# EAGLE schematic axiom_beta_main_board_v0.37_r1.2 (EAGLE 7.7.0)
Assembly variants: Beta, Tele, Min

## Sheet 1 of 6
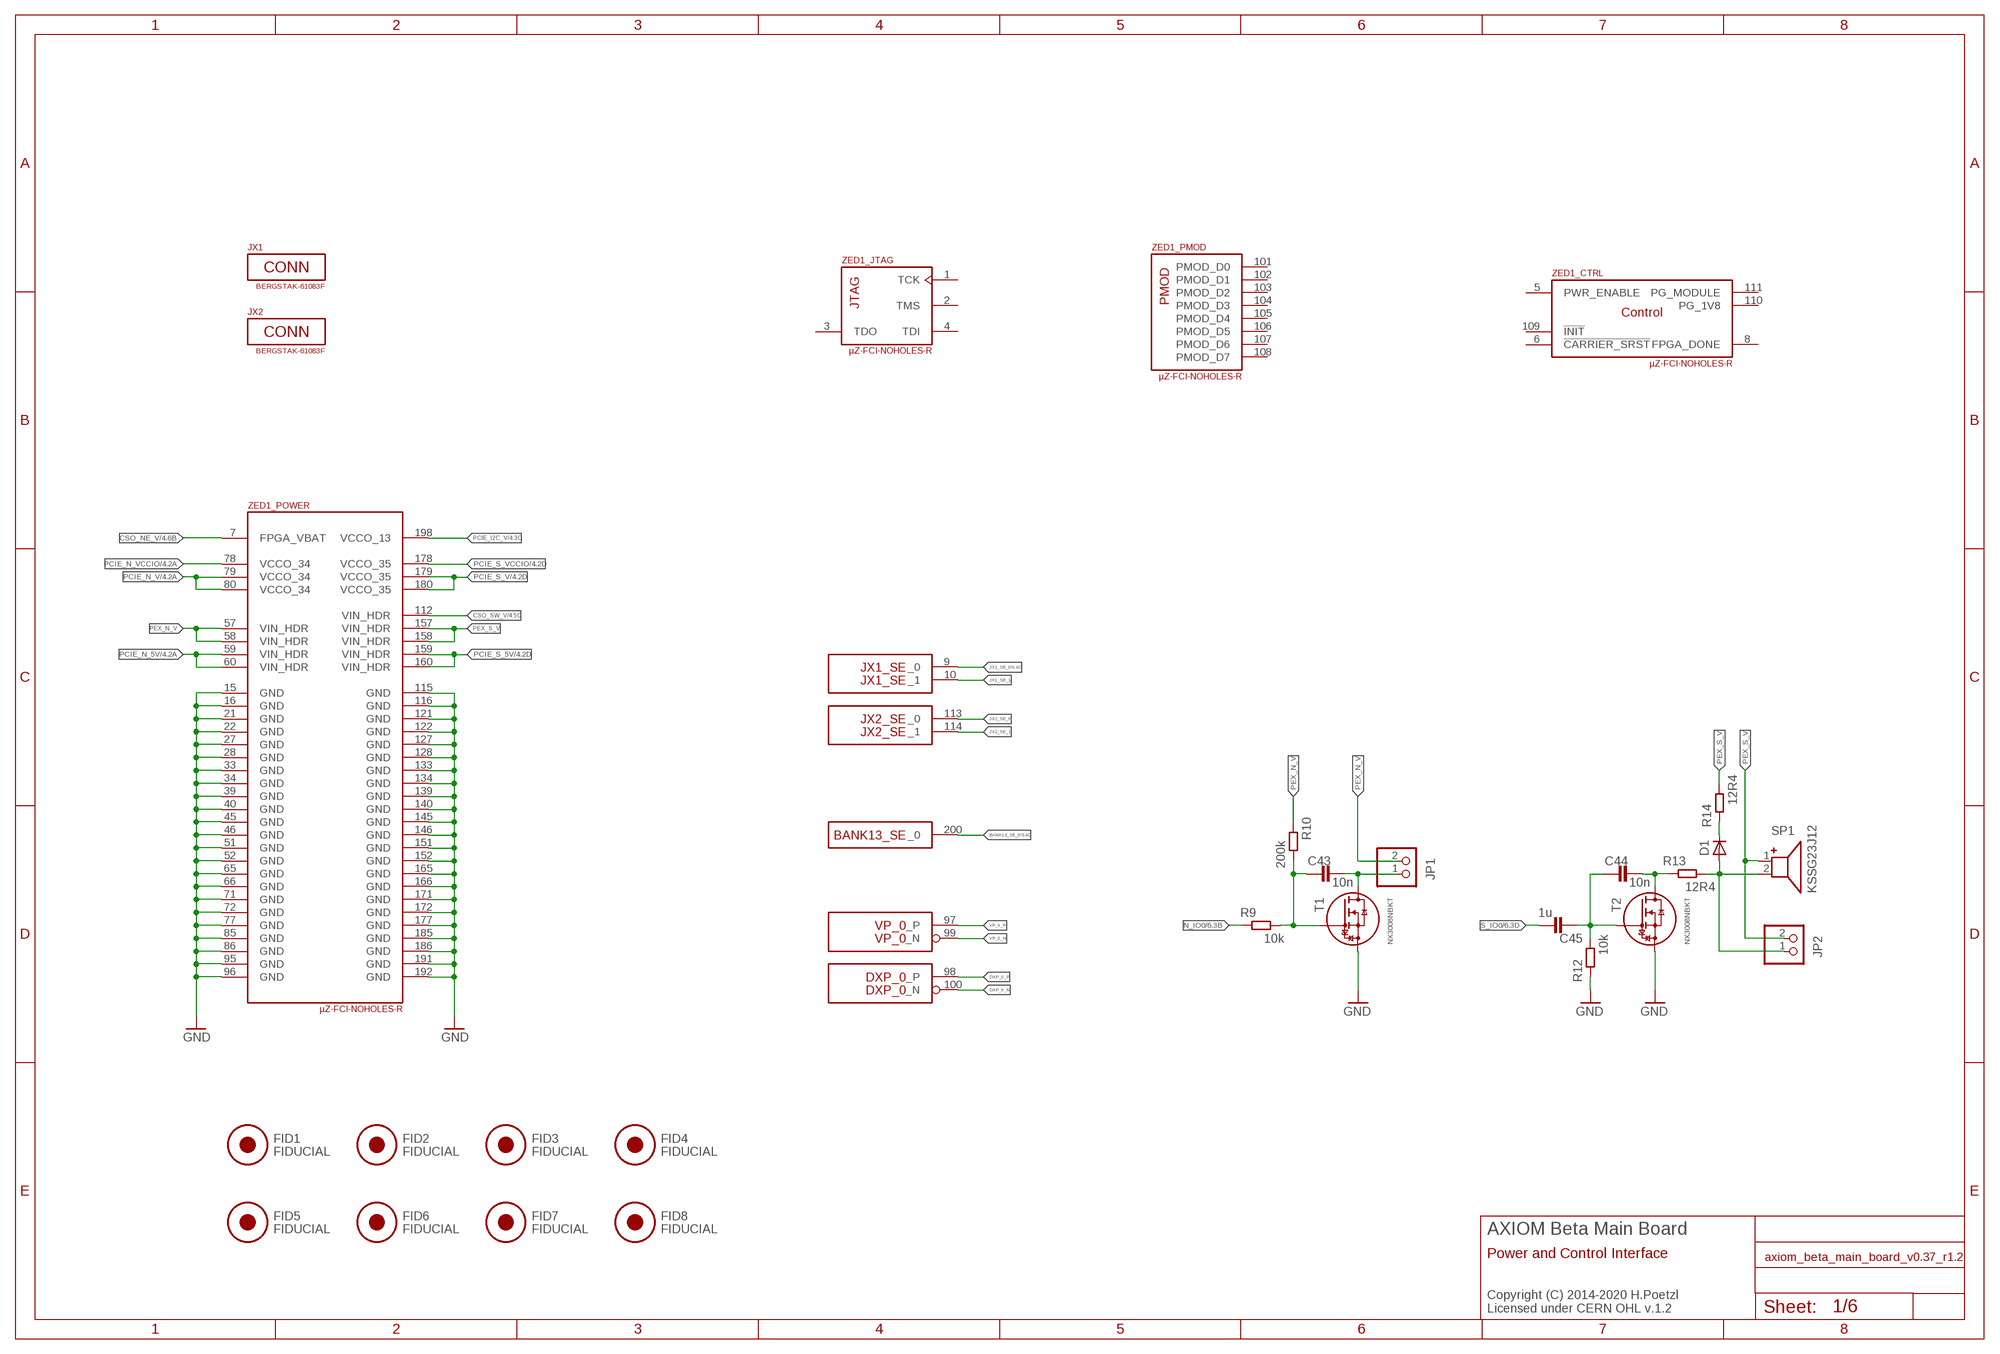
[diagram p0: schematic, sheet 1]

### Parts
C43  10n  C0402-B  [0402-B]
C44  10n  C0402-B  [0402-B]  (not fitted in variant Tele)
C45  1u  C0402-B  [0402-B]  (not fitted in variant Tele)
D1  DB2S20500L  DIODE-MICROMELF-R  [MICROMELF-R]  (not fitted in variant Tele)
FID1  FIDUCIAL  [FID_ARROW]
FID2  FIDUCIAL  [FID_ARROW]
FID3  FIDUCIAL  [FID_ARROW]
FID4  FIDUCIAL  [FID_ARROW]
FID5  FIDUCIAL  [FID_ARROW]
FID6  FIDUCIAL  [FID_ARROW]
FID7  FIDUCIAL  [FID_ARROW]
FID8  FIDUCIAL  [FID_ARROW]
JP1  PINHD-1X02_2.00-90°-S  [1X02M/90-S]
JP2  PINHD-1X02_2.00  [1X02M]  (not fitted in variant Beta)  (not fitted in variant Tele)
JX1  BERGSTAK-61083F  [61083-FAKE]  (not fitted in variant Beta)  (not fitted in variant Min)
JX2  BERGSTAK-61083F  [61083-FAKE]  (not fitted in variant Beta)  (not fitted in variant Min)
R9  10k  R0402-B  [0402-B]
R10  200k  R0402-B  [0402-B]
R12  10k  R0402-B  [0402-B]  (not fitted in variant Tele)
R13  12R4  R0402-B  [0402-B]  (not fitted in variant Tele)
R14  12R4  R0402-B  [0402-B]  (not fitted in variant Tele)
SP1  KSSG23J12  [KSSG23J12]  (not fitted in variant Beta)  (not fitted in variant Tele)
T1  NX3008NBKT  [SOT416]
T2  NX3008NBKT  [SOT416]  (not fitted in variant Tele)
ZED1  µZ-FCI-NOHOLES-R  [µZ-NOHOLES-R]  (not fitted in variant Tele)

### Nets
BANK13_SE_0: ZED1.200(BANK13_SE:_0) ; also sheet 5
CSO_NE_V [power]: ZED1.7(_POWER:FPGA_VBAT) ; also sheet 4
CSO_SW_V [power]: ZED1.112(_POWER:VIN_HDR) ; also sheet 4
DXP_0_N: ZED1.100(DXP_0:_N)
DXP_0_P: ZED1.98(DXP_0:_P)
GND: R12.1 T1.2(S) T2.2(S) ZED1.15(_POWER:GND) ZED1.16(_POWER:GND) ZED1.21(_POWER:GND) ZED1.22(_POWER:GND) ZED1.27(_POWER:GND) ZED1.28(_POWER:GND) ZED1.33(_POWER:GND) ZED1.34(_POWER:GND) ZED1.39(_POWER:GND) ZED1.40(_POWER:GND) ZED1.45(_POWER:GND) ZED1.46(_POWER:GND) ZED1.51(_POWER:GND) ZED1.52(_POWER:GND) ZED1.65(_POWER:GND) ZED1.66(_POWER:GND) ZED1.71(_POWER:GND) ZED1.72(_POWER:GND) ZED1.77(_POWER:GND) ZED1.85(_POWER:GND) ZED1.86(_POWER:GND) ZED1.95(_POWER:GND) ZED1.96(_POWER:GND) ZED1.115(_POWER:GND) ZED1.116(_POWER:GND) ZED1.121(_POWER:GND) ZED1.122(_POWER:GND) ZED1.127(_POWER:GND) ZED1.128(_POWER:GND) ZED1.133(_POWER:GND) ZED1.134(_POWER:GND) ZED1.139(_POWER:GND) ZED1.140(_POWER:GND) ZED1.145(_POWER:GND) ZED1.146(_POWER:GND) ZED1.151(_POWER:GND) ZED1.152(_POWER:GND) ZED1.165(_POWER:GND) ZED1.166(_POWER:GND) ZED1.171(_POWER:GND) ZED1.172(_POWER:GND) ZED1.177(_POWER:GND) ZED1.185(_POWER:GND) ZED1.186(_POWER:GND) ZED1.191(_POWER:GND) ZED1.192(_POWER:GND) ; also sheet 3,4,5,6
JX1_SE_0: ZED1.9(JX1_SE:_0) ; also sheet 6
JX1_SE_1: ZED1.10(JX1_SE:_1)
JX2_SE_0: ZED1.113(JX2_SE:_0)
JX2_SE_1: ZED1.114(JX2_SE:_1)
N$105: C43.2 JP1.1 T1.3(D)
N$112: C44.2 R13.1 T2.3(D)
N$113: D1.C R14.1
N$115: D1.A JP2.1 R13.2 SP1.2
N$1111: C43.1 R9.2 R10.2 T1.1(G)
N$1112: C44.1 C45.1 R12.2 T2.1(G)
N_IO0: R9.1 ; also sheet 6
PCIE_I2C_V [power]: ZED1.198(_POWER:VCCO_13) ; also sheet 4
PCIE_N_5V [power]: ZED1.59(_POWER:VIN_HDR) ZED1.60(_POWER:VIN_HDR) ; also sheet 4
PCIE_N_V [power]: ZED1.79(_POWER:VCCO_34) ZED1.80(_POWER:VCCO_34) ; also sheet 4
PCIE_N_VCCIO [power]: ZED1.78(_POWER:VCCO_34) ; also sheet 4
PCIE_S_5V [power]: ZED1.159(_POWER:VIN_HDR) ZED1.160(_POWER:VIN_HDR) ; also sheet 4
PCIE_S_V [power]: ZED1.179(_POWER:VCCO_35) ZED1.180(_POWER:VCCO_35) ; also sheet 4
PCIE_S_VCCIO [power]: ZED1.178(_POWER:VCCO_35) ; also sheet 4
PEX_N_V [power]: JP1.2 R10.1 ZED1.57(_POWER:VIN_HDR) ZED1.58(_POWER:VIN_HDR)
PEX_S_V [power]: JP2.2 R14.2 SP1.1 ZED1.157(_POWER:VIN_HDR) ZED1.158(_POWER:VIN_HDR)
S_IO0: C45.2 ; also sheet 6
VP_0_N: ZED1.99(VP_0:_N)
VP_0_P: ZED1.97(VP_0:_P)
Unconnected: ZED1.1(_JTAG:TCK) ZED1.2(_JTAG:TMS) ZED1.3(_JTAG:TDO) ZED1.4(_JTAG:TDI) ZED1.5(_CTRL:PWR_ENABLE) ZED1.6(_CTRL:!CARRIER_SRST) ZED1.8(_CTRL:FPGA_DONE) ZED1.101(_PMOD:PMOD_D0) ZED1.102(_PMOD:PMOD_D1) ZED1.103(_PMOD:PMOD_D2) ZED1.104(_PMOD:PMOD_D3) ZED1.105(_PMOD:PMOD_D4) ZED1.106(_PMOD:PMOD_D5) ZED1.107(_PMOD:PMOD_D6) ZED1.108(_PMOD:PMOD_D7) ZED1.109(_CTRL:!INIT) ZED1.110(_CTRL:PG_1V8) ZED1.111(_CTRL:PG_MODULE)

### Notes on the sheet
- AXIOM Beta Main Board
- Power and Control Interface
- Copyright (C) 2014-2020 H.Poetzl
  Licensed under CERN OHL v.1.2

## Sheet 2 of 6
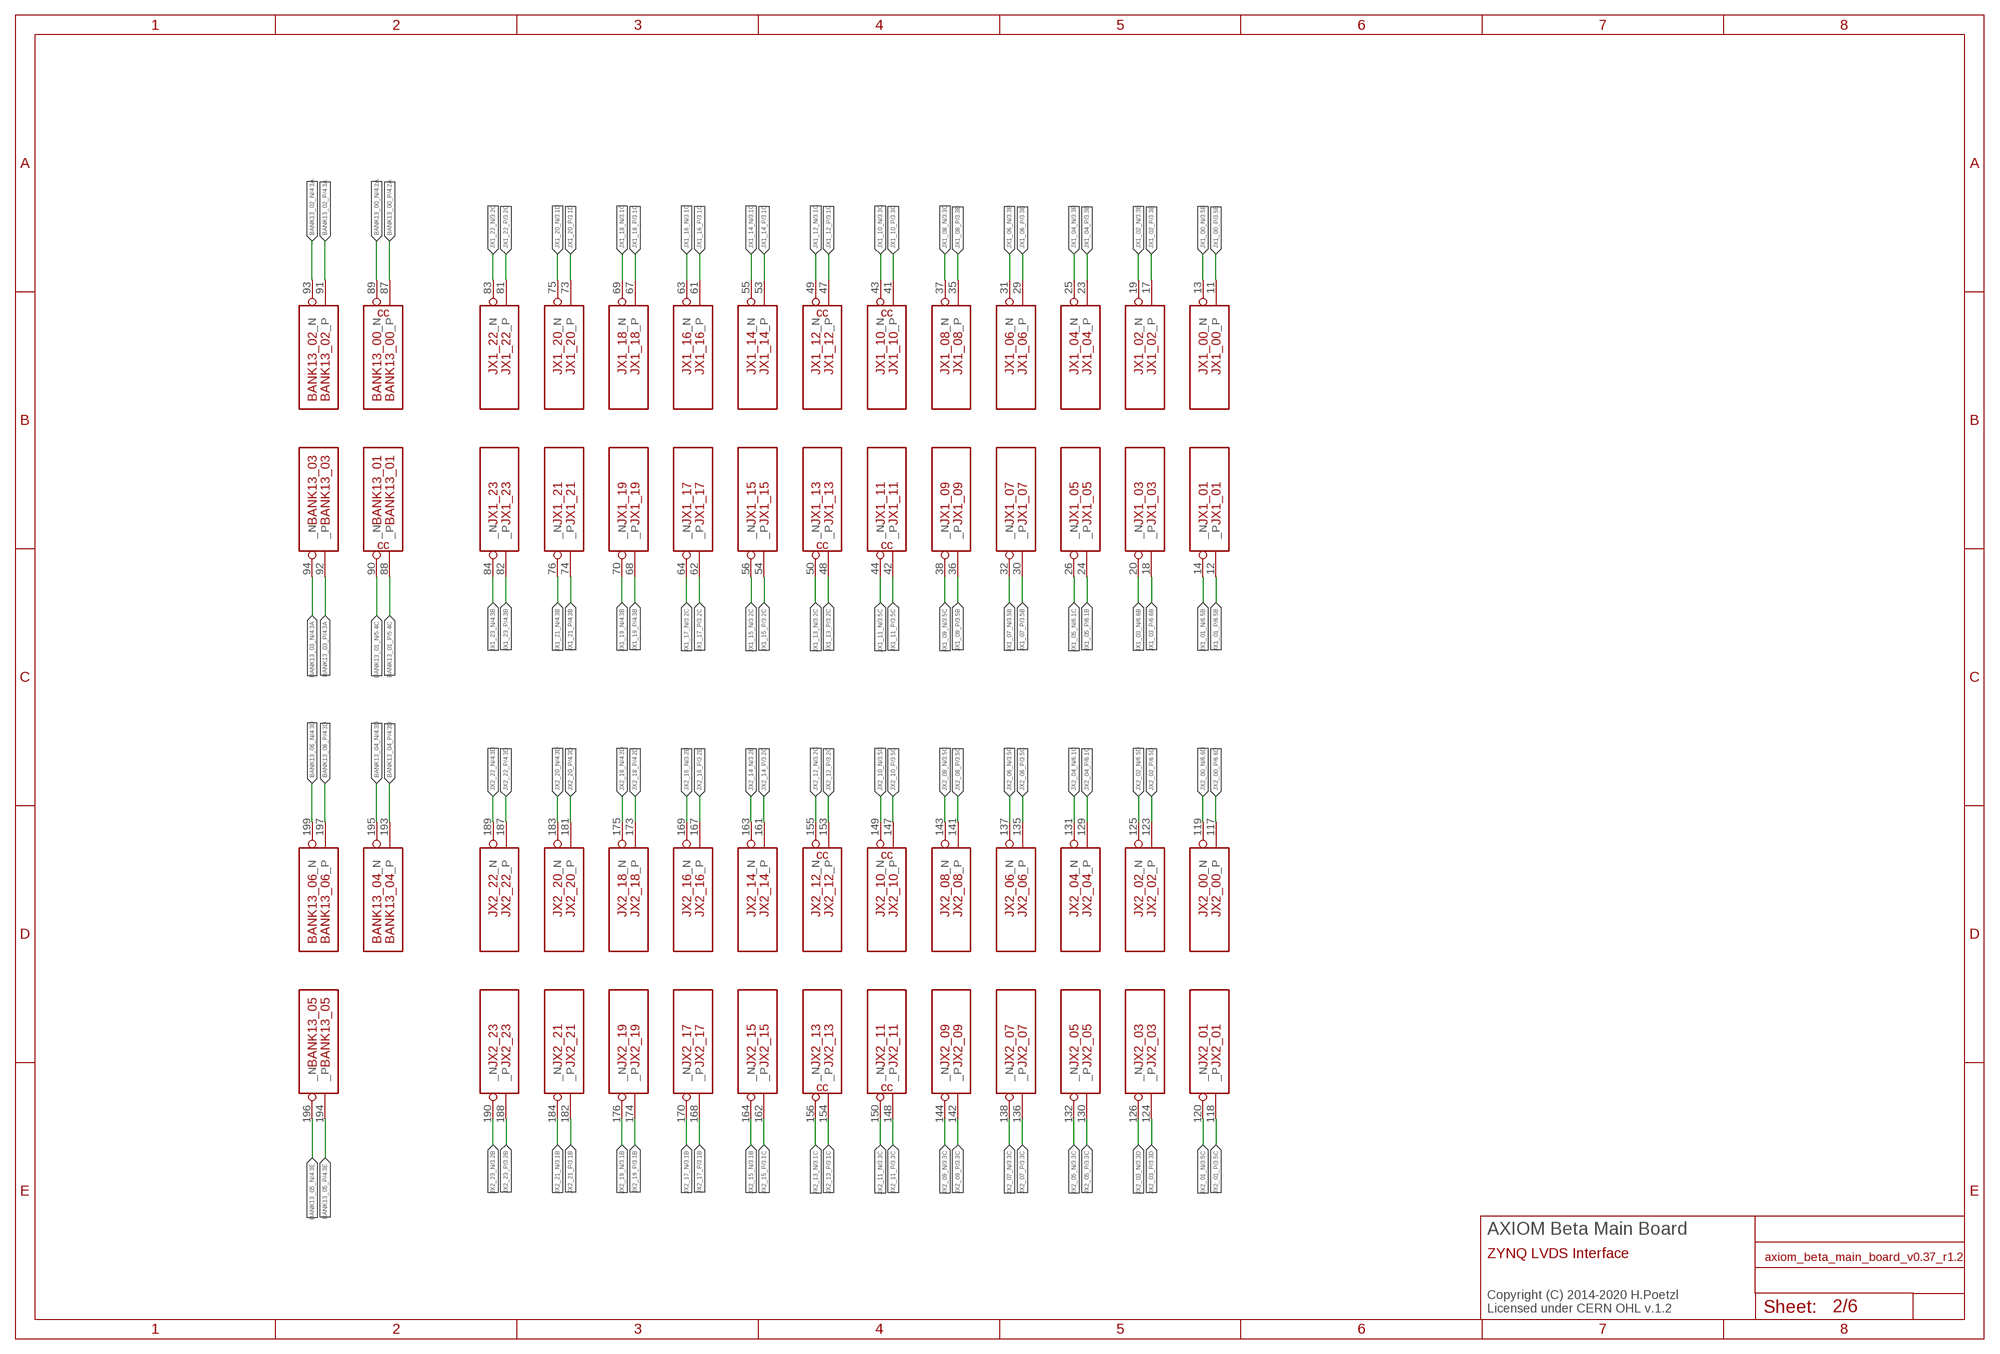
[diagram p1: schematic, sheet 2]

### Nets
BANK13_00_N [LVDS]: ZED1.89(BANK13_00:_N) ; also sheet 4
BANK13_00_P [LVDS]: ZED1.87(BANK13_00:_P) ; also sheet 4
BANK13_01_N [LVDS]: ZED1.90(BANK13_01:_N) ; also sheet 5
BANK13_01_P [LVDS]: ZED1.88(BANK13_01:_P) ; also sheet 5
BANK13_02_N [LVDS]: ZED1.93(BANK13_02:_N) ; also sheet 4
BANK13_02_P [LVDS]: ZED1.91(BANK13_02:_P) ; also sheet 4
BANK13_03_N [LVDS]: ZED1.94(BANK13_03:_N) ; also sheet 4
BANK13_03_P [LVDS]: ZED1.92(BANK13_03:_P) ; also sheet 4
BANK13_04_N [LVDS]: ZED1.195(BANK13_04:_N) ; also sheet 4
BANK13_04_P [LVDS]: ZED1.193(BANK13_04:_P) ; also sheet 4
BANK13_05_N [LVDS]: ZED1.196(BANK13_05:_N) ; also sheet 4
BANK13_05_P [LVDS]: ZED1.194(BANK13_05:_P) ; also sheet 4
BANK13_06_N [LVDS]: ZED1.199(BANK13_06:_N) ; also sheet 4
BANK13_06_P [LVDS]: ZED1.197(BANK13_06:_P) ; also sheet 4
JX1_00_N [LVDS]: ZED1.13(JX1_00:_N) ; also sheet 3
JX1_00_P [LVDS]: ZED1.11(JX1_00:_P) ; also sheet 3
JX1_01_N [LVDS]: ZED1.14(JX1_01:_N) ; also sheet 6
JX1_01_P [LVDS]: ZED1.12(JX1_01:_P) ; also sheet 6
JX1_02_N [LVDS]: ZED1.19(JX1_02:_N) ; also sheet 3
JX1_02_P [LVDS]: ZED1.17(JX1_02:_P) ; also sheet 3
JX1_03_N [LVDS]: ZED1.20(JX1_03:_N) ; also sheet 6
JX1_03_P [LVDS]: ZED1.18(JX1_03:_P) ; also sheet 6
JX1_04_N [LVDS]: ZED1.25(JX1_04:_N) ; also sheet 3
JX1_04_P [LVDS]: ZED1.23(JX1_04:_P) ; also sheet 3
JX1_05_N [LVDS]: ZED1.26(JX1_05:_N) ; also sheet 6
JX1_05_P [LVDS]: ZED1.24(JX1_05:_P) ; also sheet 6
JX1_06_N [LVDS]: ZED1.31(JX1_06:_N) ; also sheet 3
JX1_06_P [LVDS]: ZED1.29(JX1_06:_P) ; also sheet 3
JX1_07_N [LVDS]: ZED1.32(JX1_07:_N) ; also sheet 3
JX1_07_P [LVDS]: ZED1.30(JX1_07:_P) ; also sheet 3
JX1_08_N [LVDS]: ZED1.37(JX1_08:_N) ; also sheet 3
JX1_08_P [LVDS]: ZED1.35(JX1_08:_P) ; also sheet 3
JX1_09_N [LVDS]: ZED1.38(JX1_09:_N) ; also sheet 3
JX1_09_P [LVDS]: ZED1.36(JX1_09:_P) ; also sheet 3
JX1_10_N [LVDS]: ZED1.43(JX1_10:_N) ; also sheet 3
JX1_10_P [LVDS]: ZED1.41(JX1_10:_P) ; also sheet 3
JX1_11_N [LVDS]: ZED1.44(JX1_11:_N) ; also sheet 3
JX1_11_P [LVDS]: ZED1.42(JX1_11:_P) ; also sheet 3
JX1_12_N [LVDS]: ZED1.49(JX1_12:_N) ; also sheet 3
JX1_12_P [LVDS]: ZED1.47(JX1_12:_P) ; also sheet 3
JX1_13_N [LVDS]: ZED1.50(JX1_13:_N) ; also sheet 3
JX1_13_P [LVDS]: ZED1.48(JX1_13:_P) ; also sheet 3
JX1_14_N: ZED1.55(JX1_14:_N) ; also sheet 3
JX1_14_P [LVDS]: ZED1.53(JX1_14:_P) ; also sheet 3
JX1_15_N [LVDS]: ZED1.56(JX1_15:_N) ; also sheet 3
JX1_15_P [LVDS]: ZED1.54(JX1_15:_P) ; also sheet 3
JX1_16_N [LVDS]: ZED1.63(JX1_16:_N) ; also sheet 3
JX1_16_P [LVDS]: ZED1.61(JX1_16:_P) ; also sheet 3
JX1_17_N [LVDS]: ZED1.64(JX1_17:_N) ; also sheet 3
JX1_17_P [LVDS]: ZED1.62(JX1_17:_P) ; also sheet 3
JX1_18_N [LVDS]: ZED1.69(JX1_18:_N) ; also sheet 3
JX1_18_P [LVDS]: ZED1.67(JX1_18:_P) ; also sheet 3
JX1_19_N [LVDS]: ZED1.70(JX1_19:_N) ; also sheet 4
JX1_19_P [LVDS]: ZED1.68(JX1_19:_P) ; also sheet 4
JX1_20_N [LVDS]: ZED1.75(JX1_20:_N) ; also sheet 3
JX1_20_P [LVDS]: ZED1.73(JX1_20:_P) ; also sheet 3
JX1_21_N [LVDS]: ZED1.76(JX1_21:_N) ; also sheet 4
JX1_21_P [LVDS]: ZED1.74(JX1_21:_P) ; also sheet 4
JX1_22_N [LVDS]: ZED1.83(JX1_22:_N) ; also sheet 3
JX1_22_P [LVDS]: ZED1.81(JX1_22:_P) ; also sheet 3
JX1_23_N [LVDS]: ZED1.84(JX1_23:_N) ; also sheet 4
JX1_23_P [LVDS]: ZED1.82(JX1_23:_P) ; also sheet 4
JX2_00_N [LVDS]: ZED1.119(JX2_00:_N) ; also sheet 6
JX2_00_P [LVDS]: ZED1.117(JX2_00:_P) ; also sheet 6
JX2_01_N [LVDS]: ZED1.120(JX2_01:_N) ; also sheet 3
JX2_01_P [LVDS]: ZED1.118(JX2_01:_P) ; also sheet 3
JX2_02_N [LVDS]: ZED1.125(JX2_02:_N) ; also sheet 6
JX2_02_P [LVDS]: ZED1.123(JX2_02:_P) ; also sheet 6
JX2_03_N [LVDS]: ZED1.126(JX2_03:_N) ; also sheet 3
JX2_03_P [LVDS]: ZED1.124(JX2_03:_P) ; also sheet 3
JX2_04_N [LVDS]: ZED1.131(JX2_04:_N) ; also sheet 6
JX2_04_P [LVDS]: ZED1.129(JX2_04:_P) ; also sheet 6
JX2_05_N [LVDS]: ZED1.132(JX2_05:_N) ; also sheet 3
JX2_05_P [LVDS]: ZED1.130(JX2_05:_P) ; also sheet 3
JX2_06_N [LVDS]: ZED1.137(JX2_06:_N) ; also sheet 3
JX2_06_P [LVDS]: ZED1.135(JX2_06:_P) ; also sheet 3
JX2_07_N [LVDS]: ZED1.138(JX2_07:_N) ; also sheet 3
JX2_07_P [LVDS]: ZED1.136(JX2_07:_P) ; also sheet 3
JX2_08_N [LVDS]: ZED1.143(JX2_08:_N) ; also sheet 3
JX2_08_P [LVDS]: ZED1.141(JX2_08:_P) ; also sheet 3
JX2_09_N [LVDS]: ZED1.144(JX2_09:_N) ; also sheet 3
JX2_09_P [LVDS]: ZED1.142(JX2_09:_P) ; also sheet 3
JX2_10_N [LVDS]: ZED1.149(JX2_10:_N) ; also sheet 3
JX2_10_P [LVDS]: ZED1.147(JX2_10:_P) ; also sheet 3
JX2_11_N [LVDS]: ZED1.150(JX2_11:_N) ; also sheet 3
JX2_11_P [LVDS]: ZED1.148(JX2_11:_P) ; also sheet 3
JX2_12_N [LVDS]: ZED1.155(JX2_12:_N) ; also sheet 3
JX2_12_P [LVDS]: ZED1.153(JX2_12:_P) ; also sheet 3
JX2_13_N [LVDS]: ZED1.156(JX2_13:_N) ; also sheet 3
JX2_13_P [LVDS]: ZED1.154(JX2_13:_P) ; also sheet 3
JX2_14_N [LVDS]: ZED1.163(JX2_14:_N) ; also sheet 3
JX2_14_P [LVDS]: ZED1.161(JX2_14:_P) ; also sheet 3
JX2_15_N [LVDS]: ZED1.164(JX2_15:_N) ; also sheet 3
JX2_15_P [LVDS]: ZED1.162(JX2_15:_P) ; also sheet 3
JX2_16_N [LVDS]: ZED1.169(JX2_16:_N) ; also sheet 3
JX2_16_P [LVDS]: ZED1.167(JX2_16:_P) ; also sheet 3
JX2_17_N [LVDS]: ZED1.170(JX2_17:_N) ; also sheet 3
JX2_17_P [LVDS]: ZED1.168(JX2_17:_P) ; also sheet 3
JX2_18_N [LVDS]: ZED1.175(JX2_18:_N) ; also sheet 4
JX2_18_P [LVDS]: ZED1.173(JX2_18:_P) ; also sheet 4
JX2_19_N [LVDS]: ZED1.176(JX2_19:_N) ; also sheet 3
JX2_19_P [LVDS]: ZED1.174(JX2_19:_P) ; also sheet 3
JX2_20_N [LVDS]: ZED1.183(JX2_20:_N) ; also sheet 4
JX2_20_P [LVDS]: ZED1.181(JX2_20:_P) ; also sheet 4
JX2_21_N [LVDS]: ZED1.184(JX2_21:_N) ; also sheet 3
JX2_21_P [LVDS]: ZED1.182(JX2_21:_P) ; also sheet 3
JX2_22_N [LVDS]: ZED1.189(JX2_22:_N) ; also sheet 4
JX2_22_P [LVDS]: ZED1.187(JX2_22:_P) ; also sheet 4
JX2_23_N [LVDS]: ZED1.190(JX2_23:_N) ; also sheet 3
JX2_23_P [LVDS]: ZED1.188(JX2_23:_P) ; also sheet 3

### Notes on the sheet
- AXIOM Beta Main Board
- ZYNQ LVDS Interface
- Copyright (C) 2014-2020 H.Poetzl
  Licensed under CERN OHL v.1.2

## Sheet 3 of 6
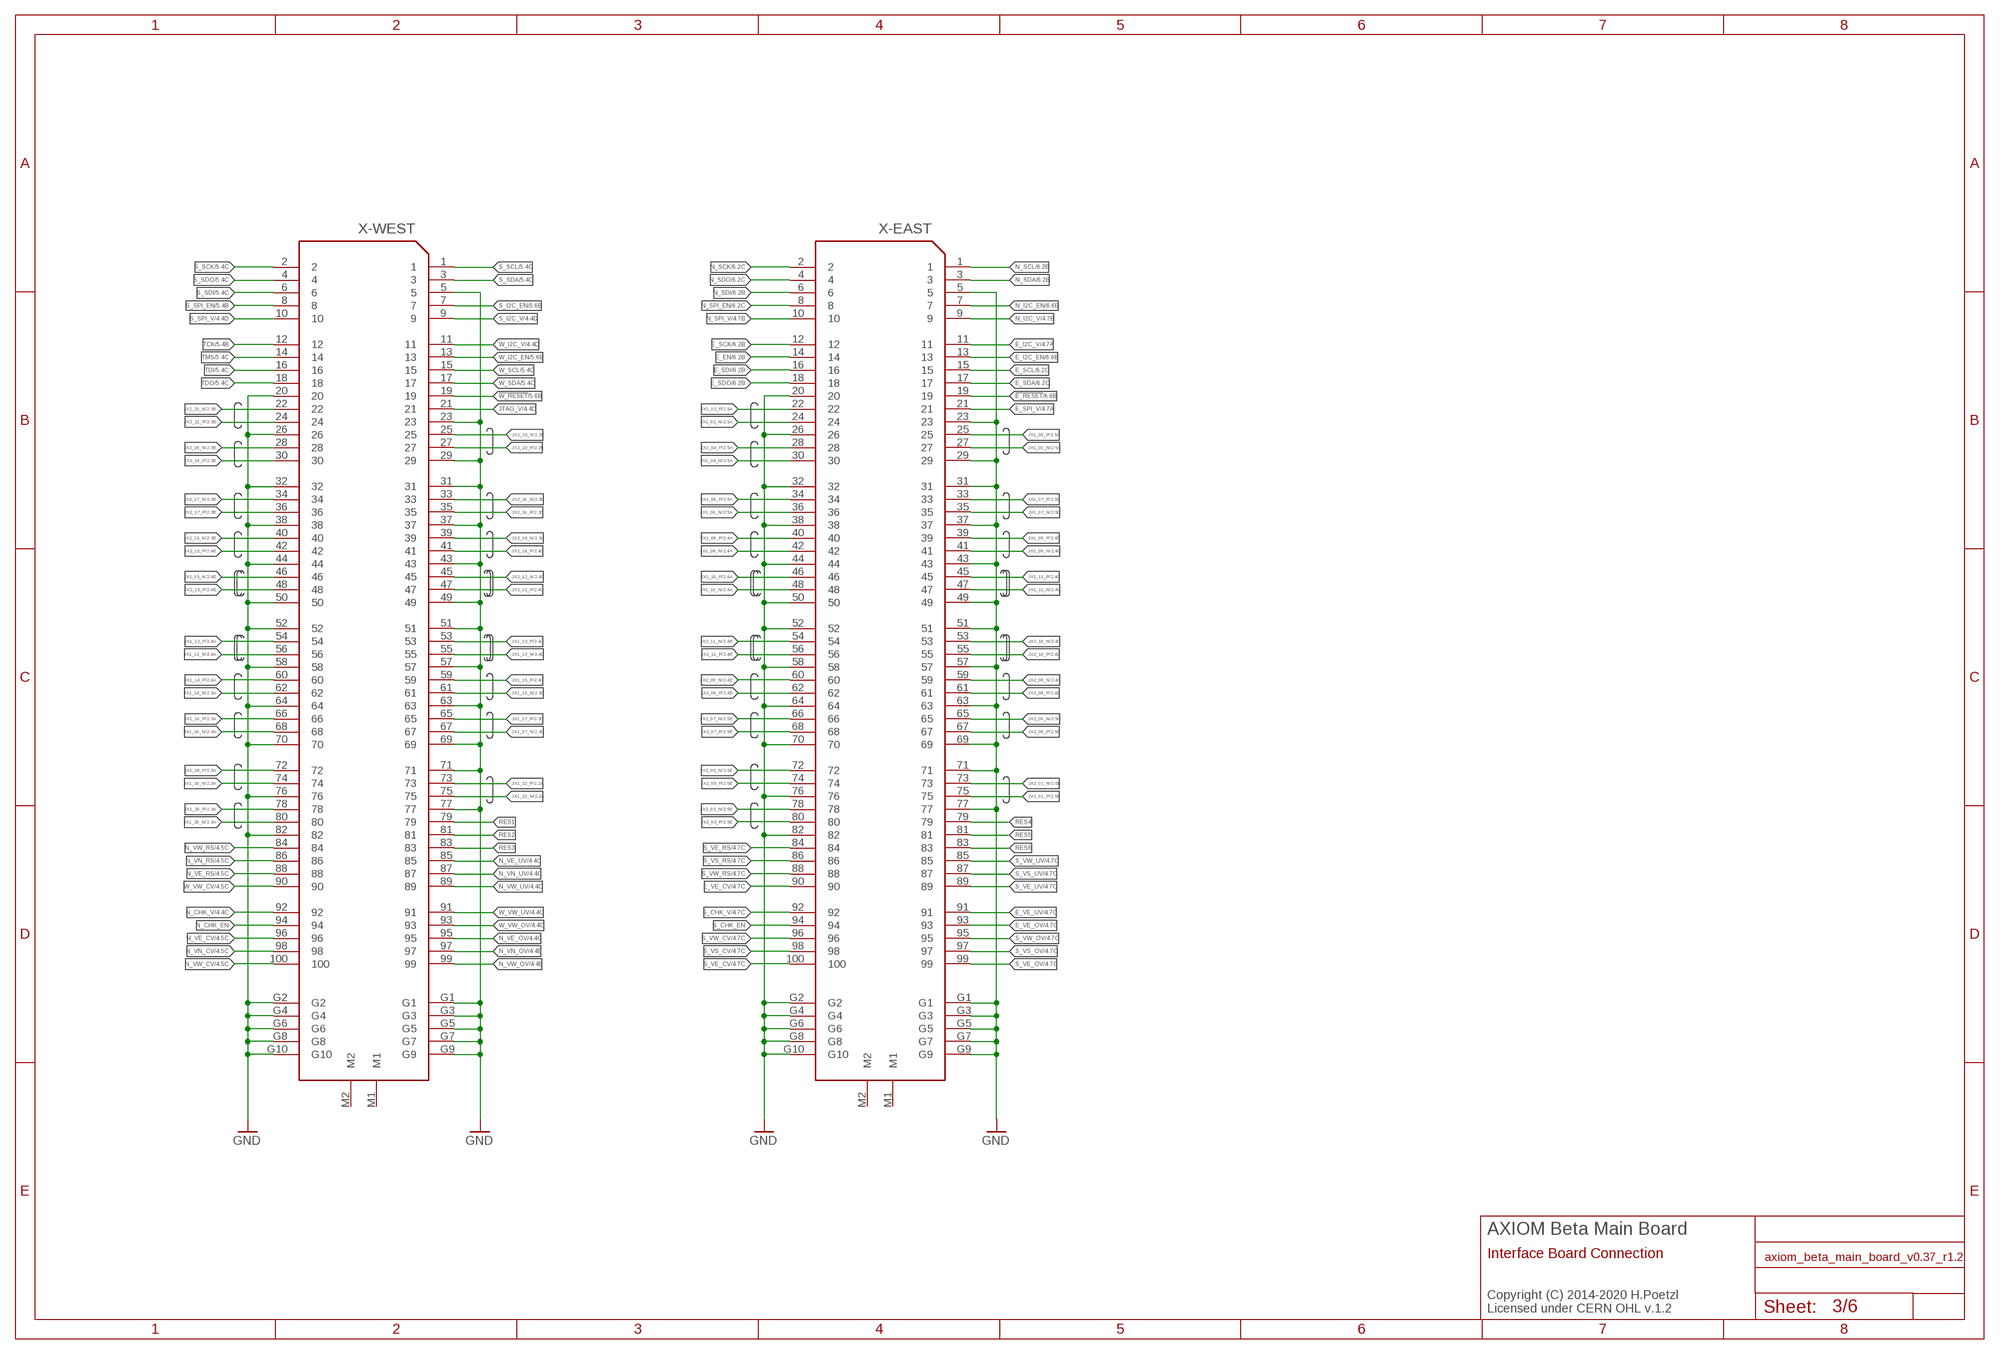
[diagram p2: schematic, sheet 3]

### Parts
X-EAST  FX10-100/10S  [FX10A-100S/10]
X-WEST  FX10-100/10S  [FX10A-100S/10]

### Nets
!E_RESET!: X-EAST.19 ; also sheet 6
!W_RESET!: X-WEST.19 ; also sheet 5
E_EN: X-EAST.14 ; also sheet 6
E_I2C_EN: X-EAST.13 ; also sheet 6
E_I2C_V [power]: X-EAST.11 ; also sheet 4
E_SCK: X-EAST.12 ; also sheet 6
E_SCL: X-EAST.15 ; also sheet 6
E_SDA: X-EAST.17 ; also sheet 6
E_SDI: X-EAST.16 ; also sheet 6
E_SDO: X-EAST.18 ; also sheet 6
E_SPI_V [power]: X-EAST.21 ; also sheet 4
E_VE_CV: X-EAST.90 ; also sheet 4
E_VE_OV: X-EAST.93 ; also sheet 4
E_VE_UV: X-EAST.91 ; also sheet 4
GND: X-EAST.5 X-EAST.20 X-EAST.23 X-EAST.26 X-EAST.29 X-EAST.31 X-EAST.32 X-EAST.37 X-EAST.38 X-EAST.43 X-EAST.44 X-EAST.49 X-EAST.50 X-EAST.51 X-EAST.52 X-EAST.57 X-EAST.58 X-EAST.63 X-EAST.64 X-EAST.69 X-EAST.70 X-EAST.71 X-EAST.76 X-EAST.77 X-EAST.82 X-EAST.G1 X-EAST.G2 X-EAST.G3 X-EAST.G4 X-EAST.G5 X-EAST.G6 X-EAST.G7 X-EAST.G8 X-EAST.G9 X-EAST.G10 X-WEST.5 X-WEST.20 X-WEST.23 X-WEST.26 X-WEST.29 X-WEST.31 X-WEST.32 X-WEST.37 X-WEST.38 X-WEST.43 X-WEST.44 X-WEST.49 X-WEST.50 X-WEST.51 X-WEST.52 X-WEST.57 X-WEST.58 X-WEST.63 X-WEST.64 X-WEST.69 X-WEST.70 X-WEST.71 X-WEST.76 X-WEST.77 X-WEST.82 X-WEST.G1 X-WEST.G2 X-WEST.G3 X-WEST.G4 X-WEST.G5 X-WEST.G6 X-WEST.G7 X-WEST.G8 X-WEST.G9 X-WEST.G10 ; also sheet 1,4,5,6
JTAG_V [power]: X-WEST.21 ; also sheet 4
JX1_00_N [LVDS]: X-EAST.27 ; also sheet 2
JX1_00_P [LVDS]: X-EAST.25 ; also sheet 2
JX1_02_N [LVDS]: X-EAST.24 ; also sheet 2
JX1_02_P [LVDS]: X-EAST.22 ; also sheet 2
JX1_04_N [LVDS]: X-EAST.30 ; also sheet 2
JX1_04_P [LVDS]: X-EAST.28 ; also sheet 2
JX1_06_N [LVDS]: X-EAST.36 ; also sheet 2
JX1_06_P [LVDS]: X-EAST.34 ; also sheet 2
JX1_07_N [LVDS]: X-EAST.35 ; also sheet 2
JX1_07_P [LVDS]: X-EAST.33 ; also sheet 2
JX1_08_N [LVDS]: X-EAST.42 ; also sheet 2
JX1_08_P [LVDS]: X-EAST.40 ; also sheet 2
JX1_09_N [LVDS]: X-EAST.41 ; also sheet 2
JX1_09_P [LVDS]: X-EAST.39 ; also sheet 2
JX1_10_N [LVDS]: X-EAST.48 ; also sheet 2
JX1_10_P [LVDS]: X-EAST.46 ; also sheet 2
JX1_11_N [LVDS]: X-EAST.47 ; also sheet 2
JX1_11_P [LVDS]: X-EAST.45 ; also sheet 2
JX1_12_N [LVDS]: X-WEST.56 ; also sheet 2
JX1_12_P [LVDS]: X-WEST.54 ; also sheet 2
JX1_13_N [LVDS]: X-WEST.55 ; also sheet 2
JX1_13_P [LVDS]: X-WEST.53 ; also sheet 2
JX1_14_N: X-WEST.62 ; also sheet 2
JX1_14_P [LVDS]: X-WEST.60 ; also sheet 2
JX1_15_N [LVDS]: X-WEST.61 ; also sheet 2
JX1_15_P [LVDS]: X-WEST.59 ; also sheet 2
JX1_16_N [LVDS]: X-WEST.68 ; also sheet 2
JX1_16_P [LVDS]: X-WEST.66 ; also sheet 2
JX1_17_N [LVDS]: X-WEST.67 ; also sheet 2
JX1_17_P [LVDS]: X-WEST.65 ; also sheet 2
JX1_18_N [LVDS]: X-WEST.74 ; also sheet 2
JX1_18_P [LVDS]: X-WEST.72 ; also sheet 2
JX1_20_N [LVDS]: X-WEST.80 ; also sheet 2
JX1_20_P [LVDS]: X-WEST.78 ; also sheet 2
JX1_22_N [LVDS]: X-WEST.75 ; also sheet 2
JX1_22_P [LVDS]: X-WEST.73 ; also sheet 2
JX2_01_N [LVDS]: X-EAST.73 ; also sheet 2
JX2_01_P [LVDS]: X-EAST.75 ; also sheet 2
JX2_03_N [LVDS]: X-EAST.78 ; also sheet 2
JX2_03_P [LVDS]: X-EAST.80 ; also sheet 2
JX2_05_N [LVDS]: X-EAST.72 ; also sheet 2
JX2_05_P [LVDS]: X-EAST.74 ; also sheet 2
JX2_06_N [LVDS]: X-EAST.65 ; also sheet 2
JX2_06_P [LVDS]: X-EAST.67 ; also sheet 2
JX2_07_N [LVDS]: X-EAST.66 ; also sheet 2
JX2_07_P [LVDS]: X-EAST.68 ; also sheet 2
JX2_08_N [LVDS]: X-EAST.59 ; also sheet 2
JX2_08_P [LVDS]: X-EAST.61 ; also sheet 2
JX2_09_N [LVDS]: X-EAST.60 ; also sheet 2
JX2_09_P [LVDS]: X-EAST.62 ; also sheet 2
JX2_10_N [LVDS]: X-EAST.53 ; also sheet 2
JX2_10_P [LVDS]: X-EAST.55 ; also sheet 2
JX2_11_N [LVDS]: X-EAST.54 ; also sheet 2
JX2_11_P [LVDS]: X-EAST.56 ; also sheet 2
JX2_12_N [LVDS]: X-WEST.45 ; also sheet 2
JX2_12_P [LVDS]: X-WEST.47 ; also sheet 2
JX2_13_N [LVDS]: X-WEST.46 ; also sheet 2
JX2_13_P [LVDS]: X-WEST.48 ; also sheet 2
JX2_14_N [LVDS]: X-WEST.39 ; also sheet 2
JX2_14_P [LVDS]: X-WEST.41 ; also sheet 2
JX2_15_N [LVDS]: X-WEST.40 ; also sheet 2
JX2_15_P [LVDS]: X-WEST.42 ; also sheet 2
JX2_16_N [LVDS]: X-WEST.33 ; also sheet 2
JX2_16_P [LVDS]: X-WEST.35 ; also sheet 2
JX2_17_N [LVDS]: X-WEST.34 ; also sheet 2
JX2_17_P [LVDS]: X-WEST.36 ; also sheet 2
JX2_19_N [LVDS]: X-WEST.28 ; also sheet 2
JX2_19_P [LVDS]: X-WEST.30 ; also sheet 2
JX2_21_N [LVDS]: X-WEST.22 ; also sheet 2
JX2_21_P [LVDS]: X-WEST.24 ; also sheet 2
JX2_23_N [LVDS]: X-WEST.25 ; also sheet 2
JX2_23_P [LVDS]: X-WEST.27 ; also sheet 2
N_CHK_EN: X-WEST.94
N_CHK_V: X-WEST.92 ; also sheet 4
N_I2C_EN: X-EAST.7 ; also sheet 6
N_I2C_V [power]: X-EAST.9 ; also sheet 4
N_SCK: X-EAST.2 ; also sheet 6
N_SCL: X-EAST.1 ; also sheet 6
N_SDA: X-EAST.3 ; also sheet 6
N_SDI: X-EAST.6 ; also sheet 6
N_SDO: X-EAST.4 ; also sheet 6
N_SPI_EN: X-EAST.8 ; also sheet 6
N_SPI_V [power]: X-EAST.10 ; also sheet 4
N_VE_CV: X-WEST.96 ; also sheet 4
N_VE_OV: X-WEST.95 ; also sheet 4
N_VE_RS: X-WEST.88 ; also sheet 4
N_VE_UV: X-WEST.85 ; also sheet 4
N_VN_CV: X-WEST.98 ; also sheet 4
N_VN_OV: X-WEST.97 ; also sheet 4
N_VN_RS: X-WEST.86 ; also sheet 4
N_VN_UV: X-WEST.87 ; also sheet 4
N_VW_CV: X-WEST.100 ; also sheet 4
N_VW_OV: X-WEST.99 ; also sheet 4
N_VW_RS: X-WEST.84 ; also sheet 4
N_VW_UV: X-WEST.89 ; also sheet 4
RES1: X-WEST.79
RES2: X-WEST.81
RES3: X-WEST.83
RES4: X-EAST.79
RES5: X-EAST.81
RES6: X-EAST.83
S_CHK_EN: X-EAST.94
S_CHK_V: X-EAST.92 ; also sheet 4
S_I2C_EN: X-WEST.7 ; also sheet 5
S_I2C_V [power]: X-WEST.9 ; also sheet 4
S_SCK: X-WEST.2 ; also sheet 5
S_SCL: X-WEST.1 ; also sheet 5
S_SDA: X-WEST.3 ; also sheet 5
S_SDI: X-WEST.6 ; also sheet 5
S_SDO: X-WEST.4 ; also sheet 5
S_SPI_EN: X-WEST.8 ; also sheet 5
S_SPI_V [power]: X-WEST.10 ; also sheet 4
S_VE_CV: X-EAST.100 ; also sheet 4
S_VE_OV: X-EAST.99 ; also sheet 4
S_VE_RS: X-EAST.84 ; also sheet 4
S_VE_UV: X-EAST.89 ; also sheet 4
S_VS_CV: X-EAST.98 ; also sheet 4
S_VS_OV: X-EAST.97 ; also sheet 4
S_VS_RS: X-EAST.86 ; also sheet 4
S_VS_UV: X-EAST.87 ; also sheet 4
S_VW_CV: X-EAST.96 ; also sheet 4
S_VW_OV: X-EAST.95 ; also sheet 4
S_VW_RS: X-EAST.88 ; also sheet 4
S_VW_UV: X-EAST.85 ; also sheet 4
TCK: X-WEST.12 ; also sheet 5
TDI: X-WEST.16 ; also sheet 5
TDO: X-WEST.18 ; also sheet 5
TMS: X-WEST.14 ; also sheet 5
W_I2C_EN: X-WEST.13 ; also sheet 5
W_I2C_V [power]: X-WEST.11 ; also sheet 4
W_SCL: X-WEST.15 ; also sheet 5
W_SDA: X-WEST.17 ; also sheet 5
W_VW_CV: X-WEST.90 ; also sheet 4
W_VW_OV: X-WEST.93 ; also sheet 4
W_VW_UV: X-WEST.91 ; also sheet 4
Unconnected: X-EAST.M1 X-EAST.M2 X-WEST.M1 X-WEST.M2

### Notes on the sheet
- AXIOM Beta Main Board
- Interface Board Connection
- Copyright (C) 2014-2020 H.Poetzl
  Licensed under CERN OHL v.1.2

## Sheet 4 of 6
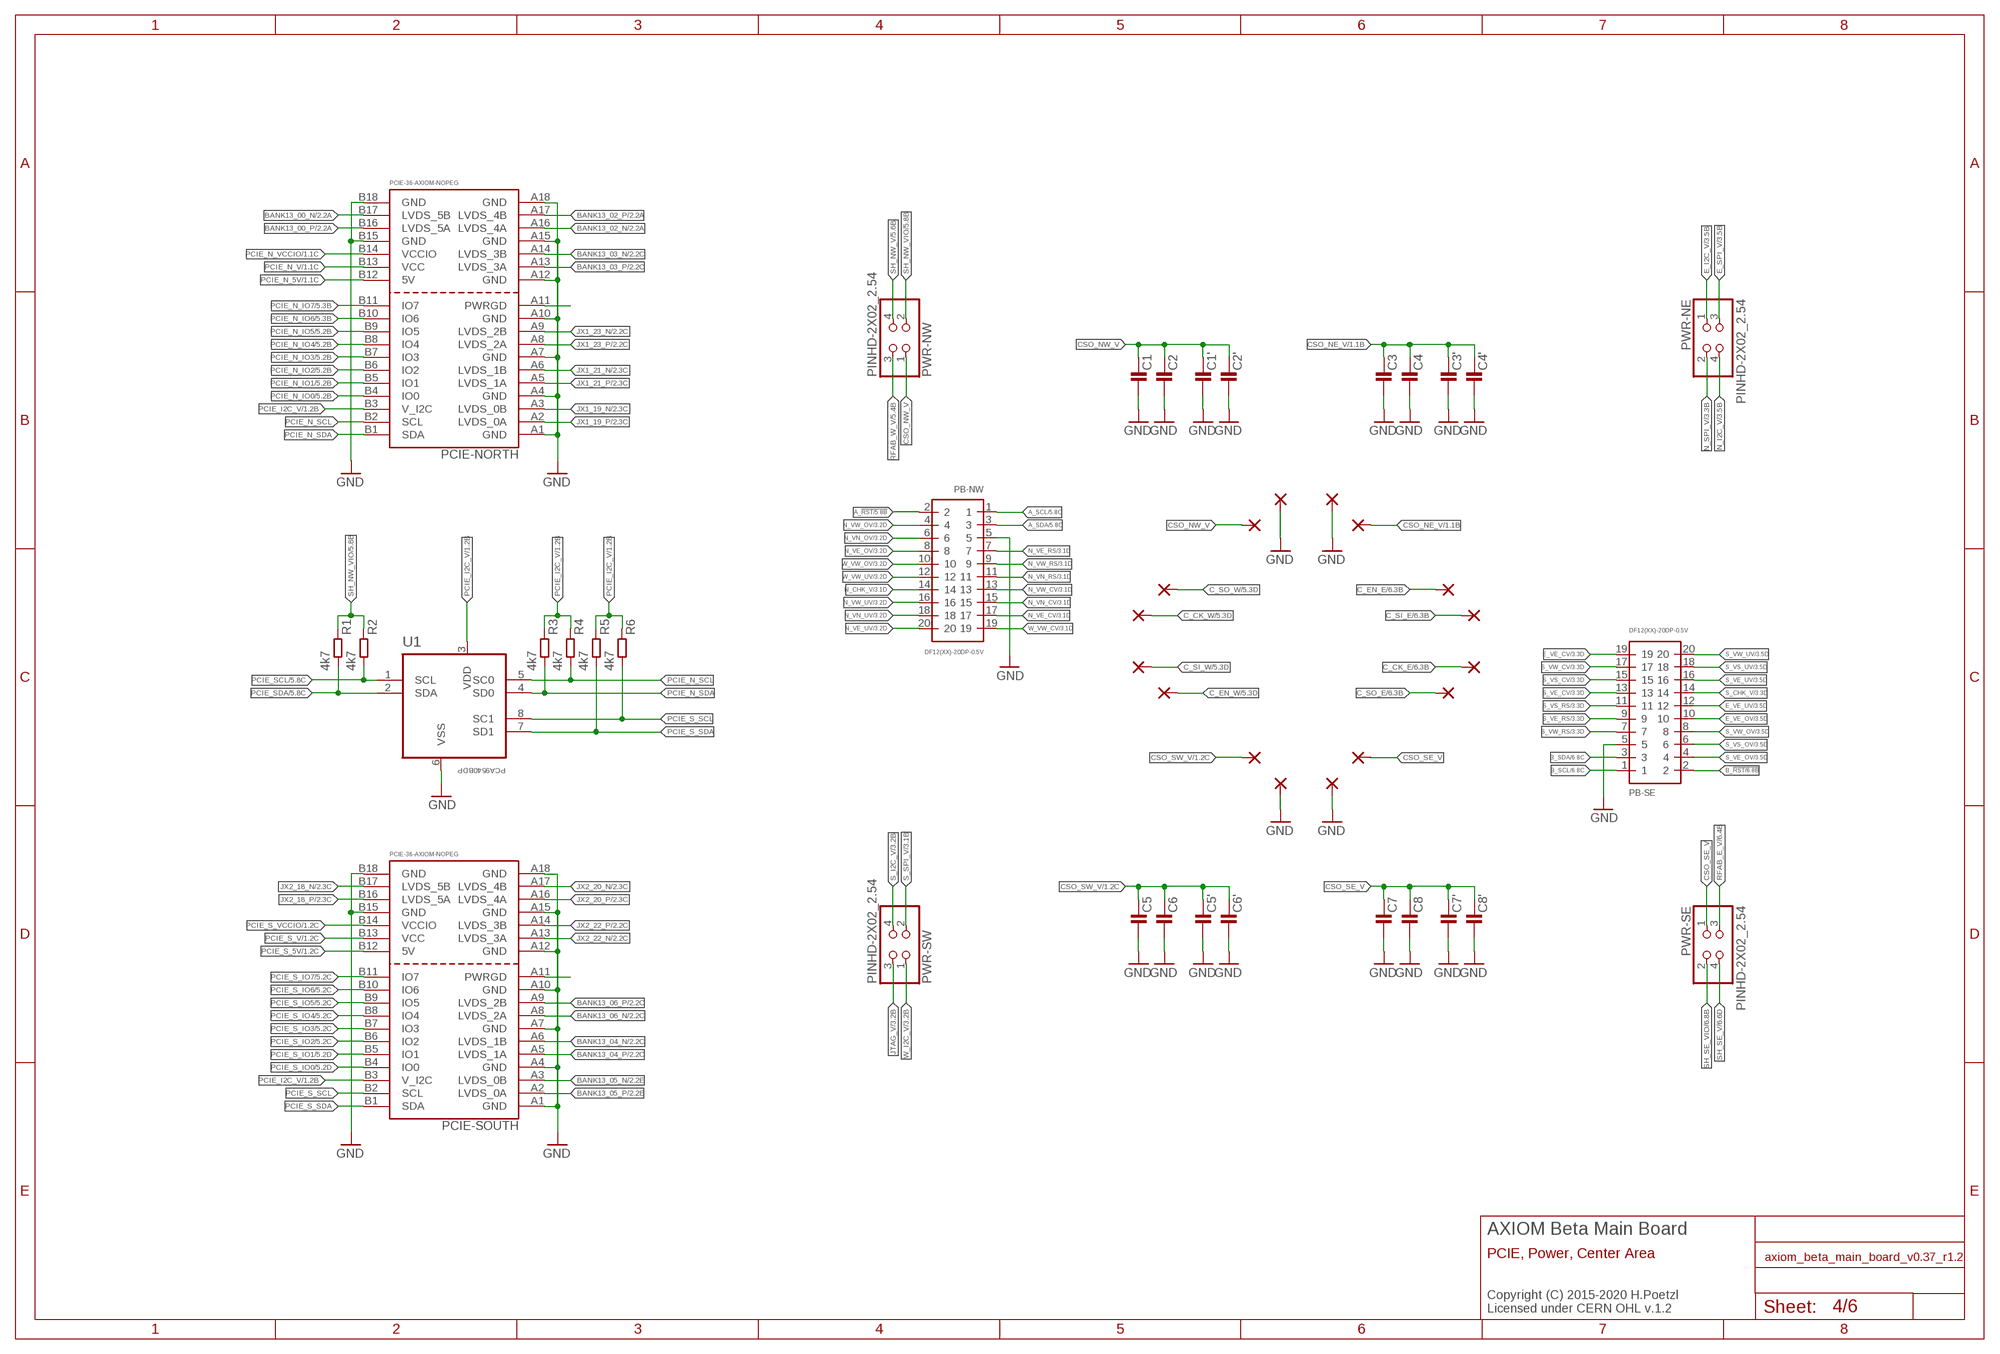
[diagram p3: schematic, sheet 4]

### Parts
C1  C0805-A  [0805-A]  (not fitted in variant Beta)  (not fitted in variant Tele)
C1'  C0805-A  [0805-A]  (not fitted in variant Beta)  (not fitted in variant Tele)
C2  C0603-A  [0603-A]  (not fitted in variant Beta)  (not fitted in variant Tele)
C2'  C0603-A  [0603-A]  (not fitted in variant Beta)  (not fitted in variant Tele)
C3  C0805-A  [0805-A]  (not fitted in variant Beta)  (not fitted in variant Tele)
C3'  C0805-A  [0805-A]  (not fitted in variant Beta)  (not fitted in variant Tele)
C4  C0603-A  [0603-A]  (not fitted in variant Beta)  (not fitted in variant Tele)
C4'  C0603-A  [0603-A]  (not fitted in variant Beta)  (not fitted in variant Tele)
C5  C0805-A  [0805-A]  (not fitted in variant Beta)  (not fitted in variant Tele)
C5'  C0805-A  [0805-A]  (not fitted in variant Beta)  (not fitted in variant Tele)
C6  C0603-A  [0603-A]  (not fitted in variant Beta)  (not fitted in variant Tele)
C6'  C0603-A  [0603-A]  (not fitted in variant Beta)  (not fitted in variant Tele)
C7  C0805-A  [0805-A]  (not fitted in variant Beta)  (not fitted in variant Tele)
C7'  C0805-A  [0805-A]  (not fitted in variant Beta)  (not fitted in variant Tele)
C8  C0603-A  [0603-A]  (not fitted in variant Beta)  (not fitted in variant Tele)
C8'  C0603-A  [0603-A]  (not fitted in variant Beta)  (not fitted in variant Tele)
PAD1  PINPAD1.27MM  [1.2/0.6]  (not fitted in variant Beta)  (not fitted in variant Tele)  (not fitted in variant Min)
PAD2  PINPAD1.27MM  [1.2/0.6]  (not fitted in variant Beta)  (not fitted in variant Tele)  (not fitted in variant Min)
PAD3  PINPAD1.27MM  [1.2/0.6]  (not fitted in variant Beta)  (not fitted in variant Tele)  (not fitted in variant Min)
PAD4  PINPAD1.27MM  [1.2/0.6]  (not fitted in variant Beta)  (not fitted in variant Tele)  (not fitted in variant Min)
PAD5  PINPAD1.27MM  [1.2/0.6]  (not fitted in variant Beta)  (not fitted in variant Tele)  (not fitted in variant Min)
PAD6  PINPAD1.27MM  [1.2/0.6]  (not fitted in variant Beta)  (not fitted in variant Tele)  (not fitted in variant Min)
PAD7  PINPAD1.27MM  [1.2/0.6]  (not fitted in variant Beta)  (not fitted in variant Tele)  (not fitted in variant Min)
PAD8  PINPAD1.27MM  [1.2/0.6]  (not fitted in variant Beta)  (not fitted in variant Tele)  (not fitted in variant Min)
PAD9  PINPAD1.27MM  [1.2/0.6]  (not fitted in variant Beta)  (not fitted in variant Tele)  (not fitted in variant Min)
PAD10  PINPAD1.27MM  [1.2/0.6]  (not fitted in variant Beta)  (not fitted in variant Tele)  (not fitted in variant Min)
PAD11  PINPAD1.27MM  [1.2/0.6]  (not fitted in variant Beta)  (not fitted in variant Tele)  (not fitted in variant Min)
PAD12  PINPAD1.27MM  [1.2/0.6]  (not fitted in variant Beta)  (not fitted in variant Tele)  (not fitted in variant Min)
PAD13  PINPAD1.27MM  [1.2/0.6]  (not fitted in variant Beta)  (not fitted in variant Tele)  (not fitted in variant Min)
PAD14  PINPAD1.27MM  [1.2/0.6]  (not fitted in variant Beta)  (not fitted in variant Tele)  (not fitted in variant Min)
PAD15  PINPAD1.27MM  [1.2/0.6]  (not fitted in variant Beta)  (not fitted in variant Tele)  (not fitted in variant Min)
PAD16  PINPAD1.27MM  [1.2/0.6]  (not fitted in variant Beta)  (not fitted in variant Tele)  (not fitted in variant Min)
PB-NW  DF12(XX)-20DP-0.5V  [DF12(XX)-20DP-0.5V]
PB-SE  DF12(XX)-20DP-0.5V  [DF12(XX)-20DP-0.5V]
PCIE-NORTH  PCIE-36-AXIOM-NOPEG  [PCIE-36-NOPEG]
PCIE-SOUTH  PCIE-36-AXIOM-NOPEG  [PCIE-36-NOPEG]
PWR-NE  PINHD-2X02_2.54  [2X02]  (not fitted in variant Beta)
PWR-NW  PINHD-2X02_2.54  [2X02]  (not fitted in variant Beta)
PWR-SE  PINHD-2X02_2.54  [2X02]  (not fitted in variant Beta)
PWR-SW  PINHD-2X02_2.54  [2X02]  (not fitted in variant Beta)
R1  4k7  R0402-B  [0402-B]
R2  4k7  R0402-B  [0402-B]
R3  4k7  R0402-B  [0402-B]
R4  4k7  R0402-B  [0402-B]
R5  4k7  R0402-B  [0402-B]
R6  4k7  R0402-B  [0402-B]
U1  PCA9540BDP  [SOP65P490X300-8N]

### Nets
A_!RST: PB-NW.2 ; also sheet 5
A_SCL: PB-NW.1 ; also sheet 5
A_SDA: PB-NW.3 ; also sheet 5
B_!RST: PB-SE.2 ; also sheet 6
B_SCL: PB-SE.1 ; also sheet 6
B_SDA: PB-SE.3 ; also sheet 6
BANK13_00_N [LVDS]: PCIE-NORTH.B17(LVDS_5B) ; also sheet 2
BANK13_00_P [LVDS]: PCIE-NORTH.B16(LVDS_5A) ; also sheet 2
BANK13_02_N [LVDS]: PCIE-NORTH.A16(LVDS_4A) ; also sheet 2
BANK13_02_P [LVDS]: PCIE-NORTH.A17(LVDS_4B) ; also sheet 2
BANK13_03_N [LVDS]: PCIE-NORTH.A14(LVDS_3B) ; also sheet 2
BANK13_03_P [LVDS]: PCIE-NORTH.A13(LVDS_3A) ; also sheet 2
BANK13_04_N [LVDS]: PCIE-SOUTH.A6(LVDS_1B) ; also sheet 2
BANK13_04_P [LVDS]: PCIE-SOUTH.A5(LVDS_1A) ; also sheet 2
BANK13_05_N [LVDS]: PCIE-SOUTH.A3(LVDS_0B) ; also sheet 2
BANK13_05_P [LVDS]: PCIE-SOUTH.A2(LVDS_0A) ; also sheet 2
BANK13_06_N [LVDS]: PCIE-SOUTH.A8(LVDS_2A) ; also sheet 2
BANK13_06_P [LVDS]: PCIE-SOUTH.A9(LVDS_2B) ; also sheet 2
C_CK_E: PAD5.1(P) ; also sheet 6
C_CK_W: PAD13.1(P) ; also sheet 5
C_EN_E: PAD3.1(P) ; also sheet 6
C_EN_W: PAD11.1(P) ; also sheet 5
C_SI_E: PAD4.1(P) ; also sheet 6
C_SI_W: PAD12.1(P) ; also sheet 5
C_SO_E: PAD6.1(P) ; also sheet 6
C_SO_W: PAD14.1(P) ; also sheet 5
CSO_NE_V [power]: C3'.1 C3.1 C4'.1 C4.1 PAD2.1(P) ; also sheet 1
CSO_NW_V [power]: C1'.1 C1.1 C2'.1 C2.1 PAD15.1(P) PWR-NW.1
CSO_SE_V [power]: C7'.1 C7.1 C8'.1 C8.1 PAD7.1(P) PWR-SE.1
CSO_SW_V [power]: C5'.1 C5.1 C6'.1 C6.1 PAD10.1(P) ; also sheet 1
E_I2C_V [power]: PWR-NE.1 ; also sheet 3
E_SPI_V [power]: PWR-NE.3 ; also sheet 3
E_VE_CV: PB-SE.19 ; also sheet 3
E_VE_OV: PB-SE.10 ; also sheet 3
E_VE_UV: PB-SE.12 ; also sheet 3
GND: C1'.2 C1.2 C2'.2 C2.2 C3'.2 C3.2 C4'.2 C4.2 C5'.2 C5.2 C6'.2 C6.2 C7'.2 C7.2 C8'.2 C8.2 PAD1.1(P) PAD8.1(P) PAD9.1(P) PAD16.1(P) PB-NW.5 PB-SE.5 PCIE-NORTH.A1(GND) PCIE-NORTH.A4(GND) PCIE-NORTH.A7(GND) PCIE-NORTH.A10(GND) PCIE-NORTH.A12(GND) PCIE-NORTH.A15(GND) PCIE-NORTH.A18(GND) PCIE-NORTH.B15(GND) PCIE-NORTH.B18(GND) PCIE-SOUTH.A1(GND) PCIE-SOUTH.A4(GND) PCIE-SOUTH.A7(GND) PCIE-SOUTH.A10(GND) PCIE-SOUTH.A12(GND) PCIE-SOUTH.A15(GND) PCIE-SOUTH.A18(GND) PCIE-SOUTH.B15(GND) PCIE-SOUTH.B18(GND) U1.6(VSS) ; also sheet 1,3,5,6
JTAG_V [power]: PWR-SW.3 ; also sheet 3
JX1_19_N [LVDS]: PCIE-NORTH.A3(LVDS_0B) ; also sheet 2
JX1_19_P [LVDS]: PCIE-NORTH.A2(LVDS_0A) ; also sheet 2
JX1_21_N [LVDS]: PCIE-NORTH.A6(LVDS_1B) ; also sheet 2
JX1_21_P [LVDS]: PCIE-NORTH.A5(LVDS_1A) ; also sheet 2
JX1_23_N [LVDS]: PCIE-NORTH.A9(LVDS_2B) ; also sheet 2
JX1_23_P [LVDS]: PCIE-NORTH.A8(LVDS_2A) ; also sheet 2
JX2_18_N [LVDS]: PCIE-SOUTH.B17(LVDS_5B) ; also sheet 2
JX2_18_P [LVDS]: PCIE-SOUTH.B16(LVDS_5A) ; also sheet 2
JX2_20_N [LVDS]: PCIE-SOUTH.A17(LVDS_4B) ; also sheet 2
JX2_20_P [LVDS]: PCIE-SOUTH.A16(LVDS_4A) ; also sheet 2
JX2_22_N [LVDS]: PCIE-SOUTH.A13(LVDS_3A) ; also sheet 2
JX2_22_P [LVDS]: PCIE-SOUTH.A14(LVDS_3B) ; also sheet 2
N$209: PCIE-SOUTH.A11(PWRGD)
N$256: PCIE-NORTH.A11(PWRGD)
N_CHK_V: PB-NW.14 ; also sheet 3
N_I2C_V [power]: PWR-NE.4 ; also sheet 3
N_SPI_V [power]: PWR-NE.2 ; also sheet 3
N_VE_CV: PB-NW.17 ; also sheet 3
N_VE_OV: PB-NW.8 ; also sheet 3
N_VE_RS: PB-NW.7 ; also sheet 3
N_VE_UV: PB-NW.20 ; also sheet 3
N_VN_CV: PB-NW.15 ; also sheet 3
N_VN_OV: PB-NW.6 ; also sheet 3
N_VN_RS: PB-NW.11 ; also sheet 3
N_VN_UV: PB-NW.18 ; also sheet 3
N_VW_CV: PB-NW.13 ; also sheet 3
N_VW_OV: PB-NW.4 ; also sheet 3
N_VW_RS: PB-NW.9 ; also sheet 3
N_VW_UV: PB-NW.16 ; also sheet 3
PCIE_I2C_V [power]: PCIE-NORTH.B3(V_I2C) PCIE-SOUTH.B3(V_I2C) R3.1 R4.1 R5.1 R6.1 U1.3(VDD) ; also sheet 1
PCIE_N_5V [power]: PCIE-NORTH.B12(5V) ; also sheet 1
PCIE_N_IO0: PCIE-NORTH.B4(IO0) ; also sheet 5
PCIE_N_IO1: PCIE-NORTH.B5(IO1) ; also sheet 5
PCIE_N_IO2: PCIE-NORTH.B6(IO2) ; also sheet 5
PCIE_N_IO3: PCIE-NORTH.B7(IO3) ; also sheet 5
PCIE_N_IO4: PCIE-NORTH.B8(IO4) ; also sheet 5
PCIE_N_IO5: PCIE-NORTH.B9(IO5) ; also sheet 5
PCIE_N_IO6: PCIE-NORTH.B10(IO6) ; also sheet 5
PCIE_N_IO7: PCIE-NORTH.B11(IO7) ; also sheet 5
PCIE_N_SCL: PCIE-NORTH.B2(SCL) R4.2 U1.5(SC0)
PCIE_N_SDA: PCIE-NORTH.B1(SDA) R3.2 U1.4(SD0)
PCIE_N_V [power]: PCIE-NORTH.B13(VCC) ; also sheet 1
PCIE_N_VCCIO [power]: PCIE-NORTH.B14(VCCIO) ; also sheet 1
PCIE_S_5V [power]: PCIE-SOUTH.B12(5V) ; also sheet 1
PCIE_S_IO0: PCIE-SOUTH.B4(IO0) ; also sheet 5
PCIE_S_IO1: PCIE-SOUTH.B5(IO1) ; also sheet 5
PCIE_S_IO2: PCIE-SOUTH.B6(IO2) ; also sheet 5
PCIE_S_IO3: PCIE-SOUTH.B7(IO3) ; also sheet 5
PCIE_S_IO4: PCIE-SOUTH.B8(IO4) ; also sheet 5
PCIE_S_IO5: PCIE-SOUTH.B9(IO5) ; also sheet 5
PCIE_S_IO6: PCIE-SOUTH.B10(IO6) ; also sheet 5
PCIE_S_IO7: PCIE-SOUTH.B11(IO7) ; also sheet 5
PCIE_S_SCL: PCIE-SOUTH.B2(SCL) R6.2 U1.8(SC1)
PCIE_S_SDA: PCIE-SOUTH.B1(SDA) R5.2 U1.7(SD1)
PCIE_S_V [power]: PCIE-SOUTH.B13(VCC) ; also sheet 1
PCIE_S_VCCIO [power]: PCIE-SOUTH.B14(VCCIO) ; also sheet 1
PCIE_SCL: R2.2 U1.1(SCL) ; also sheet 5
PCIE_SDA: R1.2 U1.2(SDA) ; also sheet 5
RFAB_E_V [power]: PWR-SE.3 ; also sheet 6
RFAB_W_V [power]: PWR-NW.3 ; also sheet 5
S_CHK_V: PB-SE.14 ; also sheet 3
S_I2C_V [power]: PWR-SW.4 ; also sheet 3
S_SPI_V [power]: PWR-SW.2 ; also sheet 3
S_VE_CV: PB-SE.13 ; also sheet 3
S_VE_OV: PB-SE.4 ; also sheet 3
S_VE_RS: PB-SE.9 ; also sheet 3
S_VE_UV: PB-SE.16 ; also sheet 3
S_VS_CV: PB-SE.15 ; also sheet 3
S_VS_OV: PB-SE.6 ; also sheet 3
S_VS_RS: PB-SE.11 ; also sheet 3
S_VS_UV: PB-SE.18 ; also sheet 3
S_VW_CV: PB-SE.17 ; also sheet 3
S_VW_OV: PB-SE.8 ; also sheet 3
S_VW_RS: PB-SE.7 ; also sheet 3
S_VW_UV: PB-SE.20 ; also sheet 3
SH_NW_V [power]: PWR-NW.4 ; also sheet 5
SH_NW_VIO [power]: PWR-NW.2 R1.1 R2.1 ; also sheet 5
SH_SE_V [power]: PWR-SE.4 ; also sheet 6
SH_SE_VIO [power]: PWR-SE.2 ; also sheet 6
W_I2C_V [power]: PWR-SW.1 ; also sheet 3
W_VW_CV: PB-NW.19 ; also sheet 3
W_VW_OV: PB-NW.10 ; also sheet 3
W_VW_UV: PB-NW.12 ; also sheet 3

### Notes on the sheet
- AXIOM Beta Main Board
- PCIE, Power, Center Area
- Copyright (C) 2015-2020 H.Poetzl
  Licensed under CERN OHL v.1.2

## Sheet 5 of 6
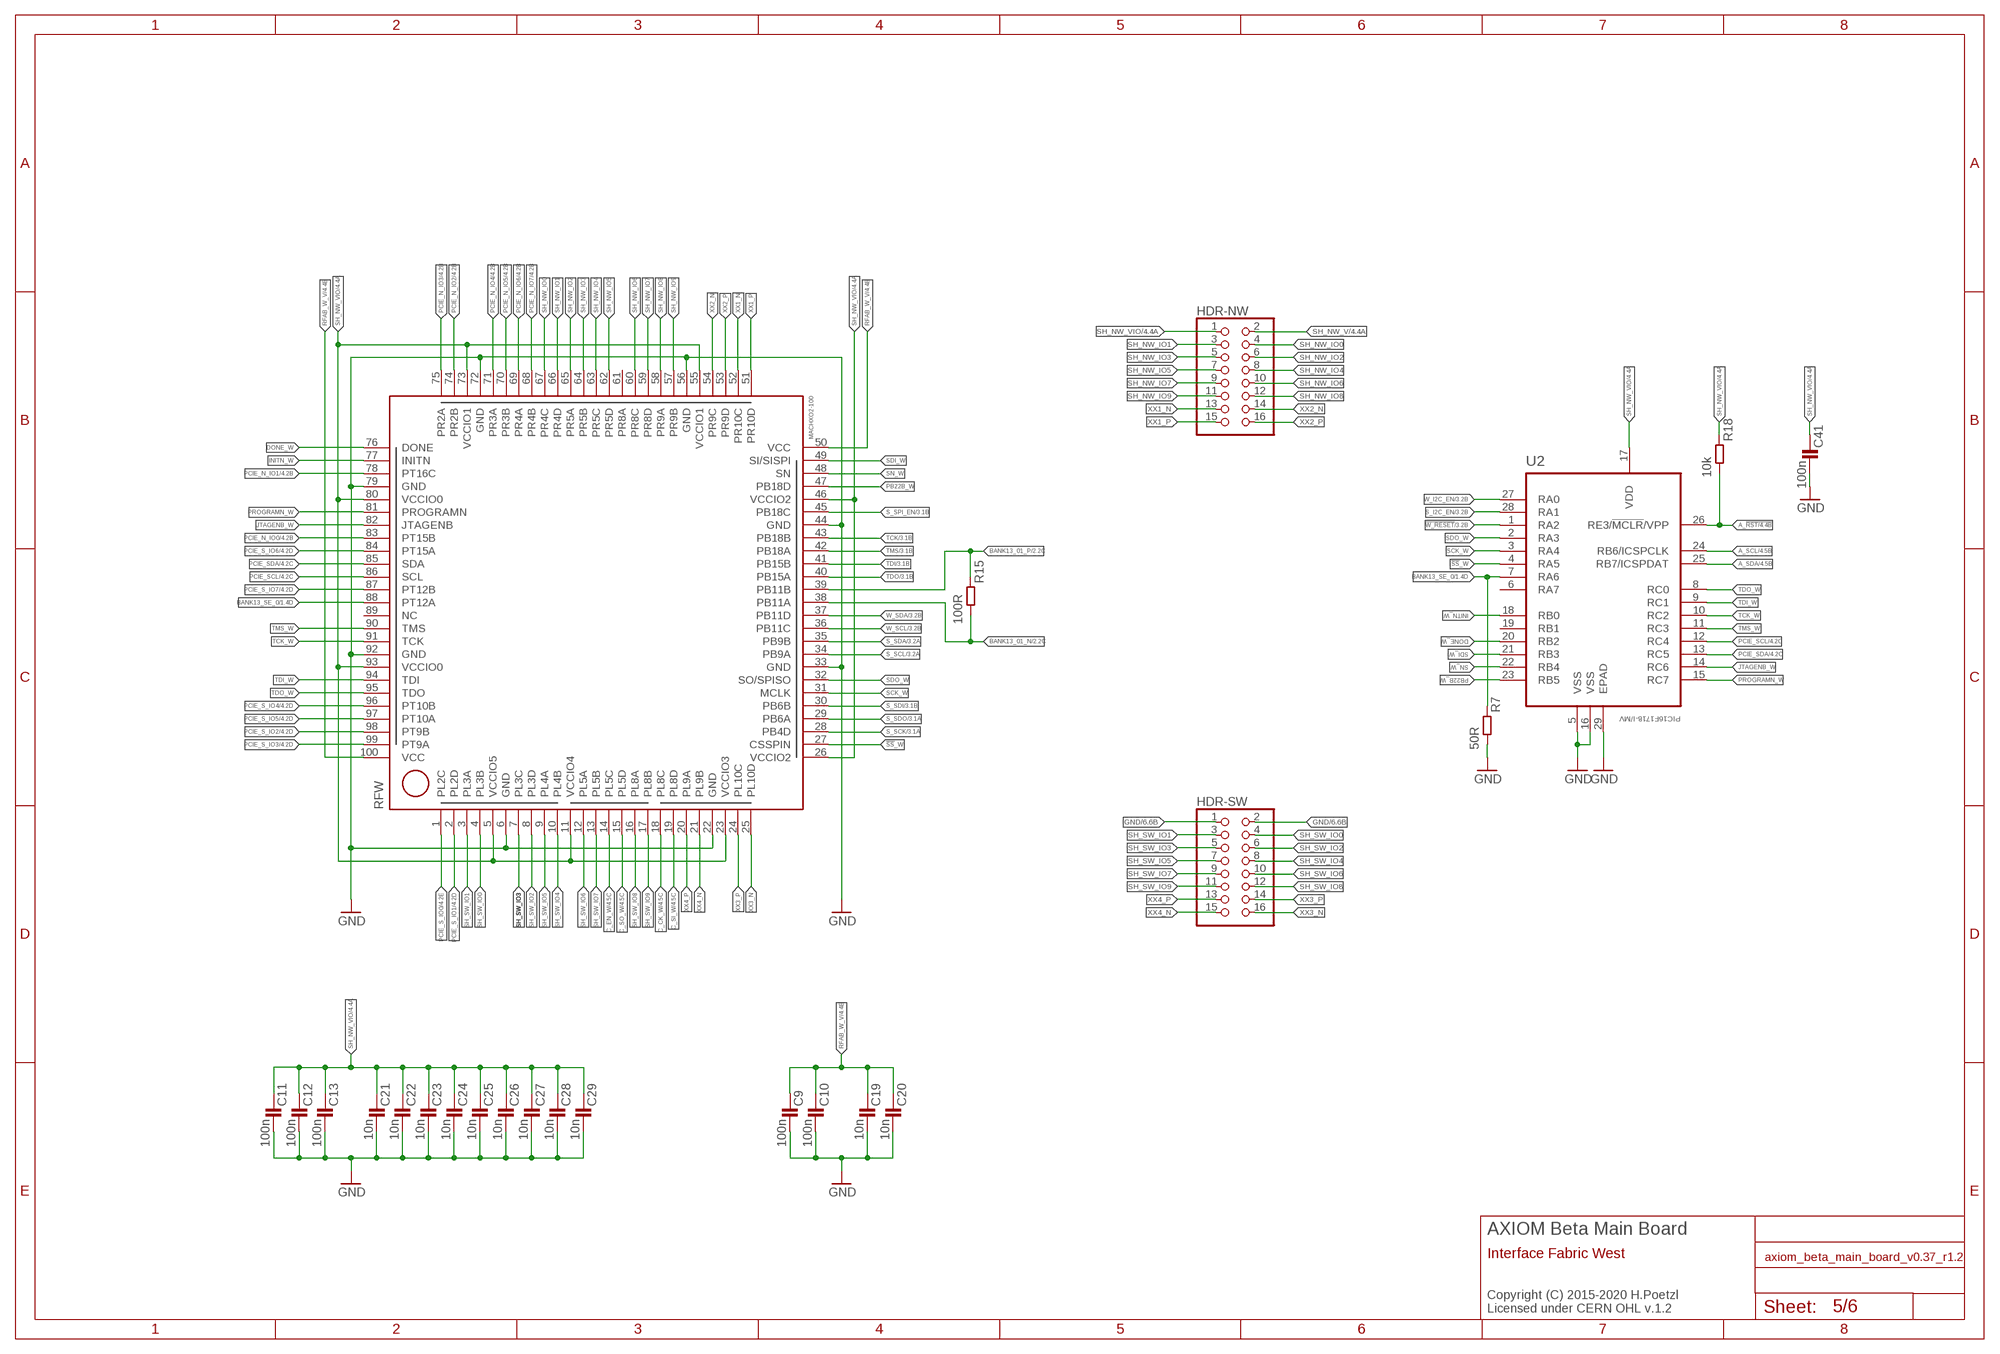
[diagram p4: schematic, sheet 5]

### Parts
C9  100n  C0402-B  [0402-B]
C10  100n  C0402-B  [0402-B]
C11  100n  C0402-B  [0402-B]
C12  100n  C0402-B  [0402-B]
C13  100n  C0402-B  [0402-B]
C19  10n  C0402-B  [0402-B]
C20  10n  C0402-B  [0402-B]
C21  10n  C0402-B  [0402-B]
C22  10n  C0402-B  [0402-B]
C23  10n  C0402-B  [0402-B]
C24  10n  C0402-B  [0402-B]
C25  10n  C0402-B  [0402-B]
C26  10n  C0402-B  [0402-B]
C27  10n  C0402-B  [0402-B]
C28  10n  C0402-B  [0402-B]
C29  10n  C0402-B  [0402-B]
C41  100n  C0402-B  [0402-B]
HDR-NW  PINHD-2X08_2.00_LPR  [62101621821]  (not fitted in variant Beta)
HDR-SW  PINHD-2X08_2.00_LPR  [62101621821]  (not fitted in variant Beta)
R7  50R  R0402-B  [0402-B]  (not fitted in variant Beta)  (not fitted in variant Tele)
R15  100R  R0201-B  [0201-B]  (not fitted in variant Beta)  (not fitted in variant Tele)
R18  10k  R0402-B  [0402-B]
RFW  MACHXO2-100  [MACHXO2-100TQFP]
U2  PIC16F1718-I/MV  [QFN40P400X400X55-29N]

### Nets
!SS!_W: RFW.27(CSSPIN) U2.4(RA5)
!W_RESET!: U2.1(RA2) ; also sheet 3
A_!RST: R18.2 U2.26(RE3/!MCLR!/VPP) ; also sheet 4
A_SCL: U2.24(RB6/ICSPCLK) ; also sheet 4
A_SDA: U2.25(RB7/ICSPDAT) ; also sheet 4
BANK13_01_N [LVDS]: R15.2 RFW.38(PB11A) ; also sheet 2
BANK13_01_P [LVDS]: R15.1 RFW.39(PB11B) ; also sheet 2
BANK13_SE_0: R7.1 RFW.88(PT12A) U2.7(RA6) ; also sheet 1
C_CK_W: RFW.18(PL8C) ; also sheet 4
C_EN_W: RFW.14(PL5C) ; also sheet 4
C_SI_W: RFW.19(PL8D) ; also sheet 4
C_SO_W: RFW.15(PL5D) ; also sheet 4
DONE_W: RFW.76(DONE) U2.20(RB2)
GND: C9.2 C10.2 C11.2 C12.2 C13.2 C19.2 C20.2 C21.2 C22.2 C23.2 C24.2 C25.2 C26.2 C27.2 C28.2 C29.2 C41.2 HDR-SW.1 HDR-SW.2 R7.2 RFW.6(GND) RFW.22(GND) RFW.33(GND) RFW.44(GND) RFW.56(GND) RFW.72(GND) RFW.79(GND) RFW.92(GND) U2.5(VSS) U2.16(VSS) U2.29(EPAD) ; also sheet 1,3,4,6
INITN_W: RFW.77(INITN) U2.18(RB0)
JTAGENB_W: RFW.82(JTAGENB) U2.14(RC6)
PB22B_W: RFW.47(PB18D) U2.23(RB5)
PCIE_N_IO0: RFW.83(PT15B) ; also sheet 4
PCIE_N_IO1: RFW.78(PT16C) ; also sheet 4
PCIE_N_IO2: RFW.74(PR2B) ; also sheet 4
PCIE_N_IO3: RFW.75(PR2A) ; also sheet 4
PCIE_N_IO4: RFW.71(PR3A) ; also sheet 4
PCIE_N_IO5: RFW.70(PR3B) ; also sheet 4
PCIE_N_IO6: RFW.69(PR4A) ; also sheet 4
PCIE_N_IO7: RFW.68(PR4B) ; also sheet 4
PCIE_S_IO0: RFW.1(PL2C) ; also sheet 4
PCIE_S_IO1: RFW.2(PL2D) ; also sheet 4
PCIE_S_IO2: RFW.98(PT9B) ; also sheet 4
PCIE_S_IO3: RFW.99(PT9A) ; also sheet 4
PCIE_S_IO4: RFW.96(PT10B) ; also sheet 4
PCIE_S_IO5: RFW.97(PT10A) ; also sheet 4
PCIE_S_IO6: RFW.84(PT15A) ; also sheet 4
PCIE_S_IO7: RFW.87(PT12B) ; also sheet 4
PCIE_SCL: RFW.86(SCL) U2.12(RC4) ; also sheet 4
PCIE_SDA: RFW.85(SDA) U2.13(RC5) ; also sheet 4
PROGRAMN_W: RFW.81(PROGRAMN) U2.15(RC7)
RFAB_W_V [power]: C9.1 C10.1 C19.1 C20.1 RFW.50(VCC) RFW.100(VCC) ; also sheet 4
S_I2C_EN: U2.28(RA1) ; also sheet 3
S_SCK: RFW.28(PB4D) ; also sheet 3
S_SCL: RFW.34(PB9A) ; also sheet 3
S_SDA: RFW.35(PB9B) ; also sheet 3
S_SDI: RFW.30(PB6B) ; also sheet 3
S_SDO: RFW.29(PB6A) ; also sheet 3
S_SPI_EN: RFW.45(PB18C) ; also sheet 3
SCK_W: RFW.31(MCLK) U2.3(RA4)
SDI_W: RFW.49(SI/SISPI) U2.21(RB3)
SDO_W: RFW.32(SO/SPISO) U2.2(RA3)
SH_NW_IO0: HDR-NW.4 RFW.67(PR4C)
SH_NW_IO1: HDR-NW.3 RFW.66(PR4D)
SH_NW_IO2: HDR-NW.6 RFW.65(PR5A)
SH_NW_IO3: HDR-NW.5 RFW.64(PR5B)
SH_NW_IO4: HDR-NW.8 RFW.63(PR5C)
SH_NW_IO5: HDR-NW.7 RFW.62(PR5D)
SH_NW_IO6: HDR-NW.10 RFW.60(PR8C)
SH_NW_IO7: HDR-NW.9 RFW.59(PR8D)
SH_NW_IO8: HDR-NW.12 RFW.58(PR9A)
SH_NW_IO9: HDR-NW.11 RFW.57(PR9B)
SH_NW_V [power]: HDR-NW.2 ; also sheet 4
SH_NW_VIO [power]: C11.1 C12.1 C13.1 C21.1 C22.1 C23.1 C24.1 C25.1 C26.1 C27.1 C28.1 C29.1 C41.1 HDR-NW.1 R18.1 RFW.5(VCCIO5) RFW.11(VCCIO4) RFW.23(VCCIO3) RFW.26(VCCIO2) RFW.46(VCCIO2) RFW.55(VCCIO1) RFW.73(VCCIO1) RFW.80(VCCIO0) RFW.93(VCCIO0) U2.17(VDD) ; also sheet 4
SH_SW_IO0: HDR-SW.4 RFW.4(PL3B)
SH_SW_IO1: HDR-SW.3 RFW.3(PL3A)
SH_SW_IO2: HDR-SW.6 RFW.8(PL3D)
SH_SW_IO3: HDR-SW.5 RFW.7(PL3C)
SH_SW_IO4: HDR-SW.8 RFW.10(PL4B)
SH_SW_IO5: HDR-SW.7 RFW.9(PL4A)
SH_SW_IO6: HDR-SW.10 RFW.12(PL5A)
SH_SW_IO7: HDR-SW.9 RFW.13(PL5B)
SH_SW_IO8: HDR-SW.12 RFW.16(PL8A)
SH_SW_IO9: HDR-SW.11 RFW.17(PL8B)
SN_W: RFW.48(SN) U2.22(RB4)
TCK: RFW.43(PB18B) ; also sheet 3
TCK_W: RFW.91(TCK) U2.10(RC2)
TDI: RFW.41(PB15B) ; also sheet 3
TDI_W: RFW.94(TDI) U2.9(RC1)
TDO: RFW.40(PB15A) ; also sheet 3
TDO_W: RFW.95(TDO) U2.8(RC0)
TMS: RFW.42(PB18A) ; also sheet 3
TMS_W: RFW.90(TMS) U2.11(RC3)
W_I2C_EN: U2.27(RA0) ; also sheet 3
W_SCL: RFW.36(PB11C) ; also sheet 3
W_SDA: RFW.37(PB11D) ; also sheet 3
XX1_N: HDR-NW.13 RFW.52(PR10C)
XX1_P: HDR-NW.15 RFW.51(PR10D)
XX2_N: HDR-NW.14 RFW.54(PR9C)
XX2_P: HDR-NW.16 RFW.53(PR9D)
XX3_N: HDR-SW.16 RFW.25(PL10D)
XX3_P: HDR-SW.14 RFW.24(PL10C)
XX4_N: HDR-SW.15 RFW.21(PL9B)
XX4_P: HDR-SW.13 RFW.20(PL9A)
Unconnected: RFW.61(PR8A) RFW.89(NC) U2.6(RA7) U2.19(RB1)

### Notes on the sheet
- AXIOM Beta Main Board
- Interface Fabric West
- Copyright (C) 2015-2020 H.Poetzl
  Licensed under CERN OHL v.1.2

## Sheet 6 of 6
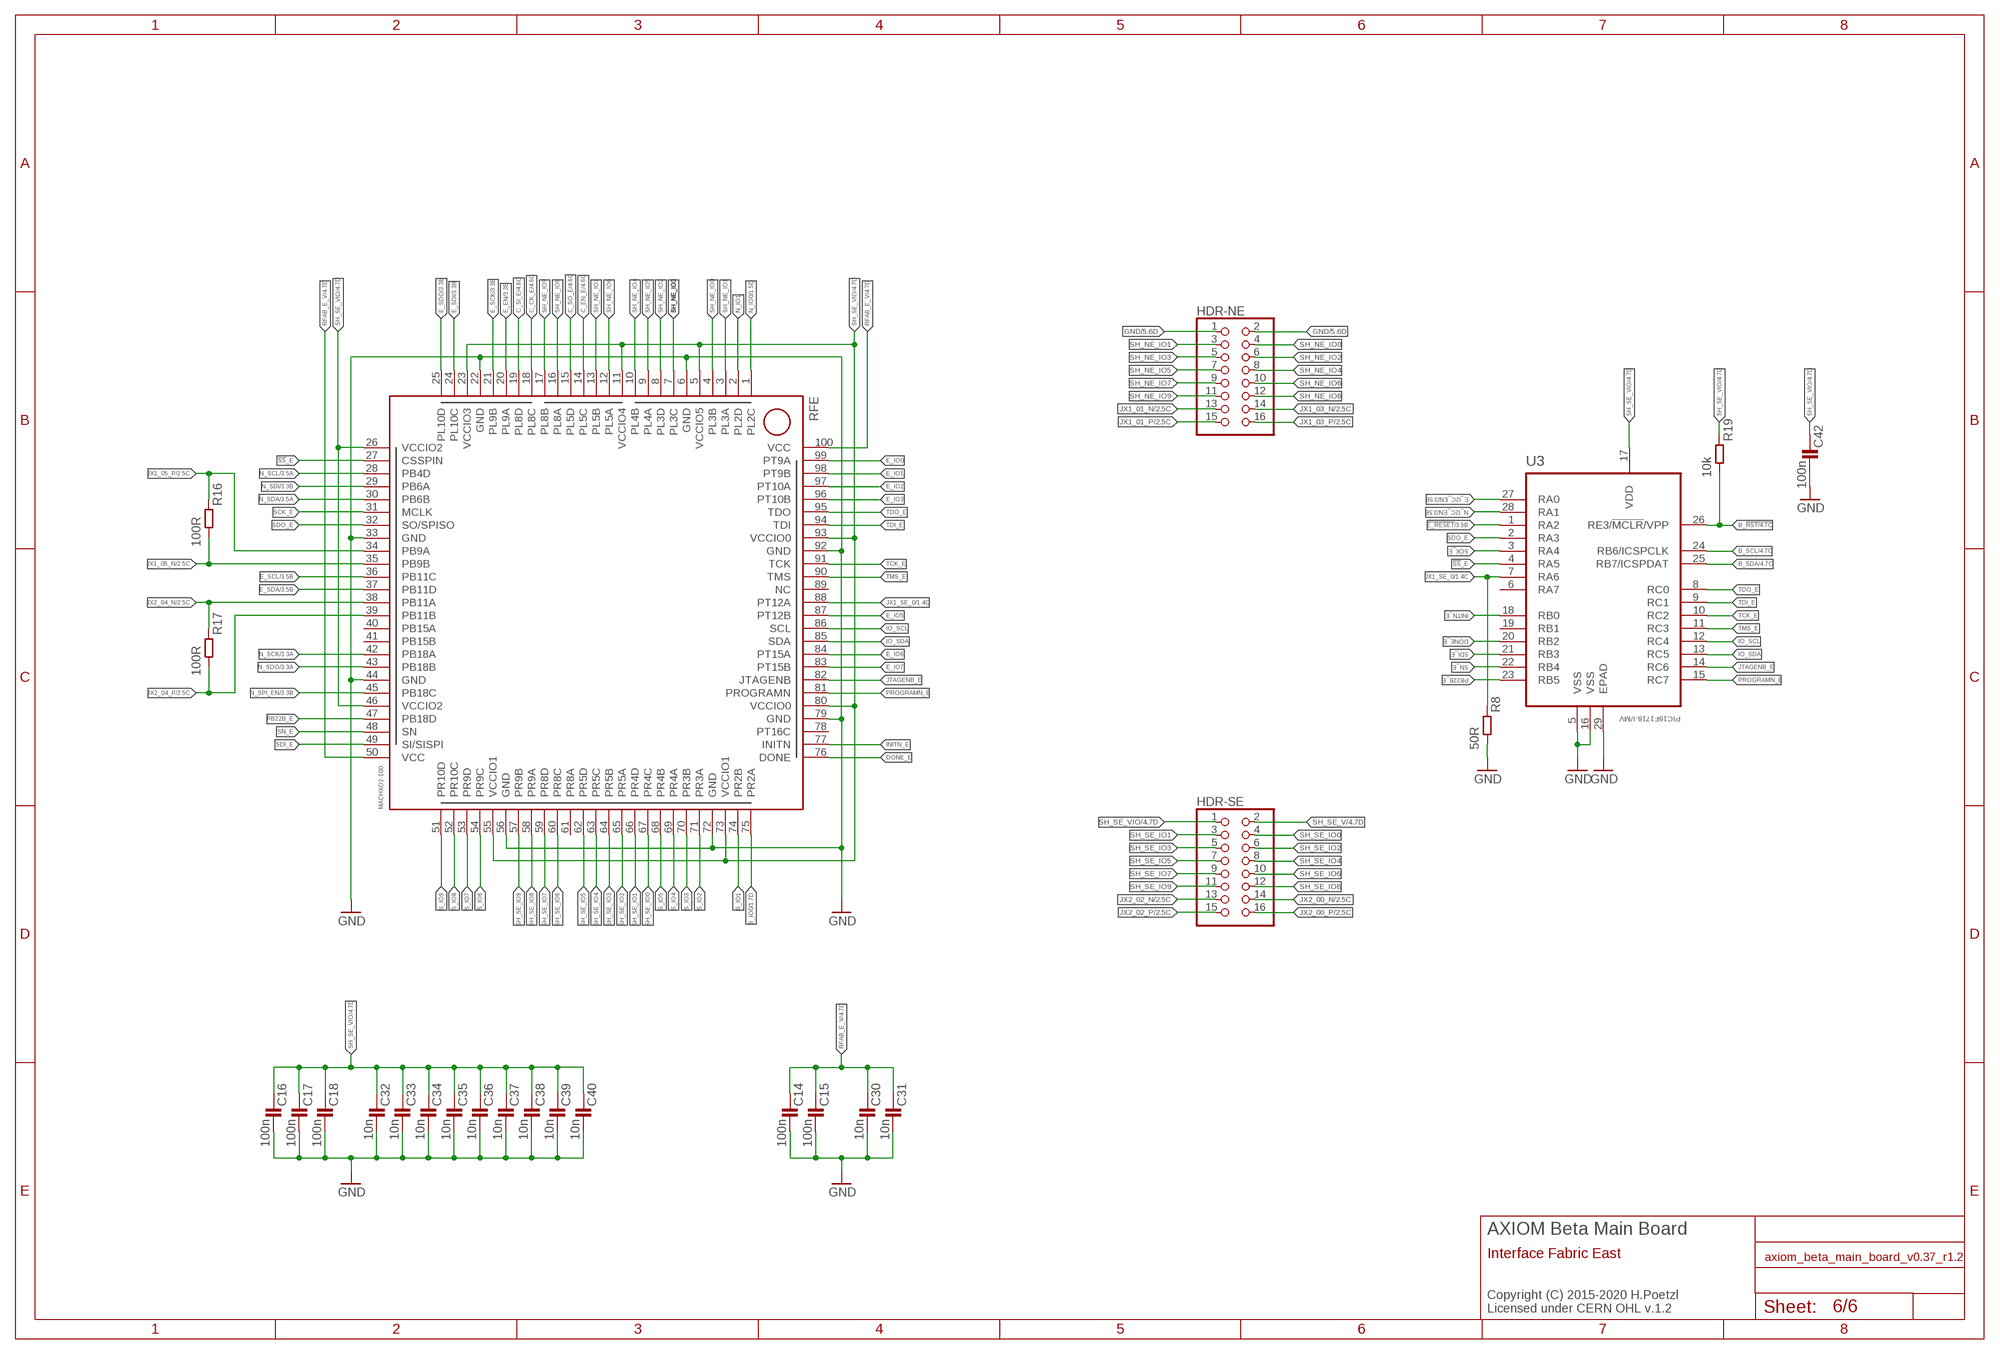
[diagram p5: schematic, sheet 6]

### Parts
C14  100n  C0402-B  [0402-B]
C15  100n  C0402-B  [0402-B]
C16  100n  C0402-B  [0402-B]
C17  100n  C0402-B  [0402-B]
C18  100n  C0402-B  [0402-B]
C30  10n  C0402-B  [0402-B]
C31  10n  C0402-B  [0402-B]
C32  10n  C0402-B  [0402-B]
C33  10n  C0402-B  [0402-B]
C34  10n  C0402-B  [0402-B]
C35  10n  C0402-B  [0402-B]
C36  10n  C0402-B  [0402-B]
C37  10n  C0402-B  [0402-B]
C38  10n  C0402-B  [0402-B]
C39  10n  C0402-B  [0402-B]
C40  10n  C0402-B  [0402-B]
C42  100n  C0402-B  [0402-B]
HDR-NE  PINHD-2X08_2.00_LPR  [62101621821]  (not fitted in variant Beta)
HDR-SE  PINHD-2X08_2.00_LPR  [62101621821]  (not fitted in variant Beta)
R8  50R  R0402-B  [0402-B]  (not fitted in variant Beta)  (not fitted in variant Tele)
R16  100R  R0201-B  [0201-B]  (not fitted in variant Beta)  (not fitted in variant Tele)
R17  100R  R0201-B  [0201-B]  (not fitted in variant Beta)  (not fitted in variant Tele)
R19  10k  R0402-B  [0402-B]
RFE  MACHXO2-100  [MACHXO2-100TQFP]
U3  PIC16F1718-I/MV  [QFN40P400X400X55-29N]

### Nets
!E_RESET!: U3.1(RA2) ; also sheet 3
!SS!_E: RFE.27(CSSPIN) U3.4(RA5)
B_!RST: R19.2 U3.26(RE3/!MCLR!/VPP) ; also sheet 4
B_SCL: U3.24(RB6/ICSPCLK) ; also sheet 4
B_SDA: U3.25(RB7/ICSPDAT) ; also sheet 4
C_CK_E: RFE.18(PL8C) ; also sheet 4
C_EN_E: RFE.14(PL5C) ; also sheet 4
C_SI_E: RFE.19(PL8D) ; also sheet 4
C_SO_E: RFE.15(PL5D) ; also sheet 4
DONE_E: RFE.76(DONE) U3.20(RB2)
E_EN: RFE.20(PL9A) ; also sheet 3
E_I2C_EN: U3.27(RA0) ; also sheet 3
E_IO0: RFE.99(PT9A)
E_IO1: RFE.98(PT9B)
E_IO2: RFE.97(PT10A)
E_IO3: RFE.96(PT10B)
E_IO5: RFE.87(PT12B)
E_IO6: RFE.84(PT15A)
E_IO7: RFE.83(PT15B)
E_SCK: RFE.21(PL9B) ; also sheet 3
E_SCL: RFE.36(PB11C) ; also sheet 3
E_SDA: RFE.37(PB11D) ; also sheet 3
E_SDI: RFE.24(PL10C) ; also sheet 3
E_SDO: RFE.25(PL10D) ; also sheet 3
GND: C14.2 C15.2 C16.2 C17.2 C18.2 C30.2 C31.2 C32.2 C33.2 C34.2 C35.2 C36.2 C37.2 C38.2 C39.2 C40.2 C42.2 HDR-NE.1 HDR-NE.2 R8.2 RFE.6(GND) RFE.22(GND) RFE.33(GND) RFE.44(GND) RFE.56(GND) RFE.72(GND) RFE.79(GND) RFE.92(GND) U3.5(VSS) U3.16(VSS) U3.29(EPAD) ; also sheet 1,3,4,5
INITN_E: RFE.77(INITN) U3.18(RB0)
IO_SCL: RFE.86(SCL) U3.12(RC4)
IO_SDA: RFE.85(SDA) U3.13(RC5)
JTAGENB_E: RFE.82(JTAGENB) U3.14(RC6)
JX1_01_N [LVDS]: HDR-NE.13 ; also sheet 2
JX1_01_P [LVDS]: HDR-NE.15 ; also sheet 2
JX1_03_N [LVDS]: HDR-NE.14 ; also sheet 2
JX1_03_P [LVDS]: HDR-NE.16 ; also sheet 2
JX1_05_N [LVDS]: R16.2 RFE.35(PB9B) ; also sheet 2
JX1_05_P [LVDS]: R16.1 RFE.34(PB9A) ; also sheet 2
JX1_SE_0: R8.1 RFE.88(PT12A) U3.7(RA6) ; also sheet 1
JX2_00_N [LVDS]: HDR-SE.14 ; also sheet 2
JX2_00_P [LVDS]: HDR-SE.16 ; also sheet 2
JX2_02_N [LVDS]: HDR-SE.13 ; also sheet 2
JX2_02_P [LVDS]: HDR-SE.15 ; also sheet 2
JX2_04_N [LVDS]: R17.1 RFE.38(PB11A) ; also sheet 2
JX2_04_P [LVDS]: R17.2 RFE.39(PB11B) ; also sheet 2
N_I2C_EN: U3.28(RA1) ; also sheet 3
N_IO0: RFE.1(PL2C) ; also sheet 1
N_IO1: RFE.2(PL2D)
N_SCK: RFE.42(PB18A) ; also sheet 3
N_SCL: RFE.28(PB4D) ; also sheet 3
N_SDA: RFE.30(PB6B) ; also sheet 3
N_SDI: RFE.29(PB6A) ; also sheet 3
N_SDO: RFE.43(PB18B) ; also sheet 3
N_SPI_EN: RFE.45(PB18C) ; also sheet 3
PB22B_E: RFE.47(PB18D) U3.23(RB5)
PROGRAMN_E: RFE.81(PROGRAMN) U3.15(RC7)
RFAB_E_V [power]: C14.1 C15.1 C30.1 C31.1 RFE.50(VCC) RFE.100(VCC) ; also sheet 4
S_IO0: RFE.75(PR2A) ; also sheet 1
S_IO1: RFE.74(PR2B)
S_IO2: RFE.71(PR3A)
S_IO3: RFE.70(PR3B)
S_IO4: RFE.69(PR4A)
S_IO5: RFE.68(PR4B)
S_IO6: RFE.54(PR9C)
S_IO7: RFE.53(PR9D)
S_IO8: RFE.52(PR10C)
S_IO9: RFE.51(PR10D)
SCK_E: RFE.31(MCLK) U3.3(RA4)
SDI_E: RFE.49(SI/SISPI) U3.21(RB3)
SDO_E: RFE.32(SO/SPISO) U3.2(RA3)
SH_NE_IO0: HDR-NE.4 RFE.4(PL3B)
SH_NE_IO1: HDR-NE.3 RFE.3(PL3A)
SH_NE_IO2: HDR-NE.6 RFE.8(PL3D)
SH_NE_IO3: HDR-NE.5 RFE.7(PL3C)
SH_NE_IO4: HDR-NE.8 RFE.10(PL4B)
SH_NE_IO5: HDR-NE.7 RFE.9(PL4A)
SH_NE_IO6: HDR-NE.10 RFE.12(PL5A)
SH_NE_IO7: HDR-NE.9 RFE.13(PL5B)
SH_NE_IO8: HDR-NE.12 RFE.16(PL8A)
SH_NE_IO9: HDR-NE.11 RFE.17(PL8B)
SH_SE_IO0: HDR-SE.4 RFE.67(PR4C)
SH_SE_IO1: HDR-SE.3 RFE.66(PR4D)
SH_SE_IO2: HDR-SE.6 RFE.65(PR5A)
SH_SE_IO3: HDR-SE.5 RFE.64(PR5B)
SH_SE_IO4: HDR-SE.8 RFE.63(PR5C)
SH_SE_IO5: HDR-SE.7 RFE.62(PR5D)
SH_SE_IO6: HDR-SE.10 RFE.60(PR8C)
SH_SE_IO7: HDR-SE.9 RFE.59(PR8D)
SH_SE_IO8: HDR-SE.12 RFE.58(PR9A)
SH_SE_IO9: HDR-SE.11 RFE.57(PR9B)
SH_SE_V [power]: HDR-SE.2 ; also sheet 4
SH_SE_VIO [power]: C16.1 C17.1 C18.1 C32.1 C33.1 C34.1 C35.1 C36.1 C37.1 C38.1 C39.1 C40.1 C42.1 HDR-SE.1 R19.1 RFE.5(VCCIO5) RFE.11(VCCIO4) RFE.23(VCCIO3) RFE.26(VCCIO2) RFE.46(VCCIO2) RFE.55(VCCIO1) RFE.73(VCCIO1) RFE.80(VCCIO0) RFE.93(VCCIO0) U3.17(VDD) ; also sheet 4
SN_E: RFE.48(SN) U3.22(RB4)
TCK_E: RFE.91(TCK) U3.10(RC2)
TDI_E: RFE.94(TDI) U3.9(RC1)
TDO_E: RFE.95(TDO) U3.8(RC0)
TMS_E: RFE.90(TMS) U3.11(RC3)
Unconnected: RFE.40(PB15A) RFE.41(PB15B) RFE.61(PR8A) RFE.78(PT16C) RFE.89(NC) U3.6(RA7) U3.19(RB1)

### Notes on the sheet
- AXIOM Beta Main Board
- Interface Fabric East
- Copyright (C) 2015-2020 H.Poetzl
  Licensed under CERN OHL v.1.2

## Library data of the parts
C1 C1' C2 C2' C3 C3' C4 C4' C5 C5' C6 C6' C7 C7' C8 C8' C9-C45 = generic-rcl:C
D1 = diode:DIODE-: DIODE; FARNELL: 2284949
FID1-FID8 = fiducial:FIDUCIAL: Fiducials
HDR-NE HDR-NW HDR-SE HDR-SW = pincon:PINHD-2X08: PIN HEADER
JP1 JP2 = pinhead-2:PINHD-1X02: PIN HEADER
JX1 JX2 = microzed:BERGSTAK
PAD1-PAD16 = pinpad:PINPAD
PB-NW PB-SE = df12:DF12(XX)-20DP-0.5V
PCIE-NORTH PCIE-SOUTH = PCIe:PCIE-36-AXIOM
PWR-NE PWR-NW PWR-SE PWR-SW = pincon:PINHD-2X02
R1-R10 R12-R19 = generic-rcl:R
RFE RFW = machxo2:MACHXO2-100: Lattice MachXO2 ultra low power, instant-on, non-volatile PLD.
SP1 = buzzer:KSSG23J12: SPEAKER Source: Schukat
T1 T2 = transistor:NX3008N: 30 V, single N-channel Trench MOSFET Herbert Poetzl
U1 = pca9540:PCA9540: IC,2-channel I²C-bus multiplexer, 8TSSOP; MPN: PCA9540BDP; OC_FARNELL: 2212116; OC_NEWARK: 55W4318; PACKAGE: TSSOP8; SUPPLIER: NXP
U2 U3 = pic16f1718:PIC16F1718: MCU, 8BIT, 14K FLASH, 28UQFN; MPN: PIC16F1718-I/MV; PACKAGE: 28-UQFN; SUPPLIER: Microchip
X-EAST X-WEST = fx10:FX10-100/10
ZED1 = microzed:µZ-FCI

## Net classes
0 default: width 0.152 mm, drill 0.203 mm
1 LVDS: width 0.152 mm, drill 0.203 mm, clearance 0.152 mm
2 power: width 0.254 mm, drill 0.254 mm, clearance 0.152 mm